# EAGLE board xio5 (EAGLE 9.5.0), part 1 of 3
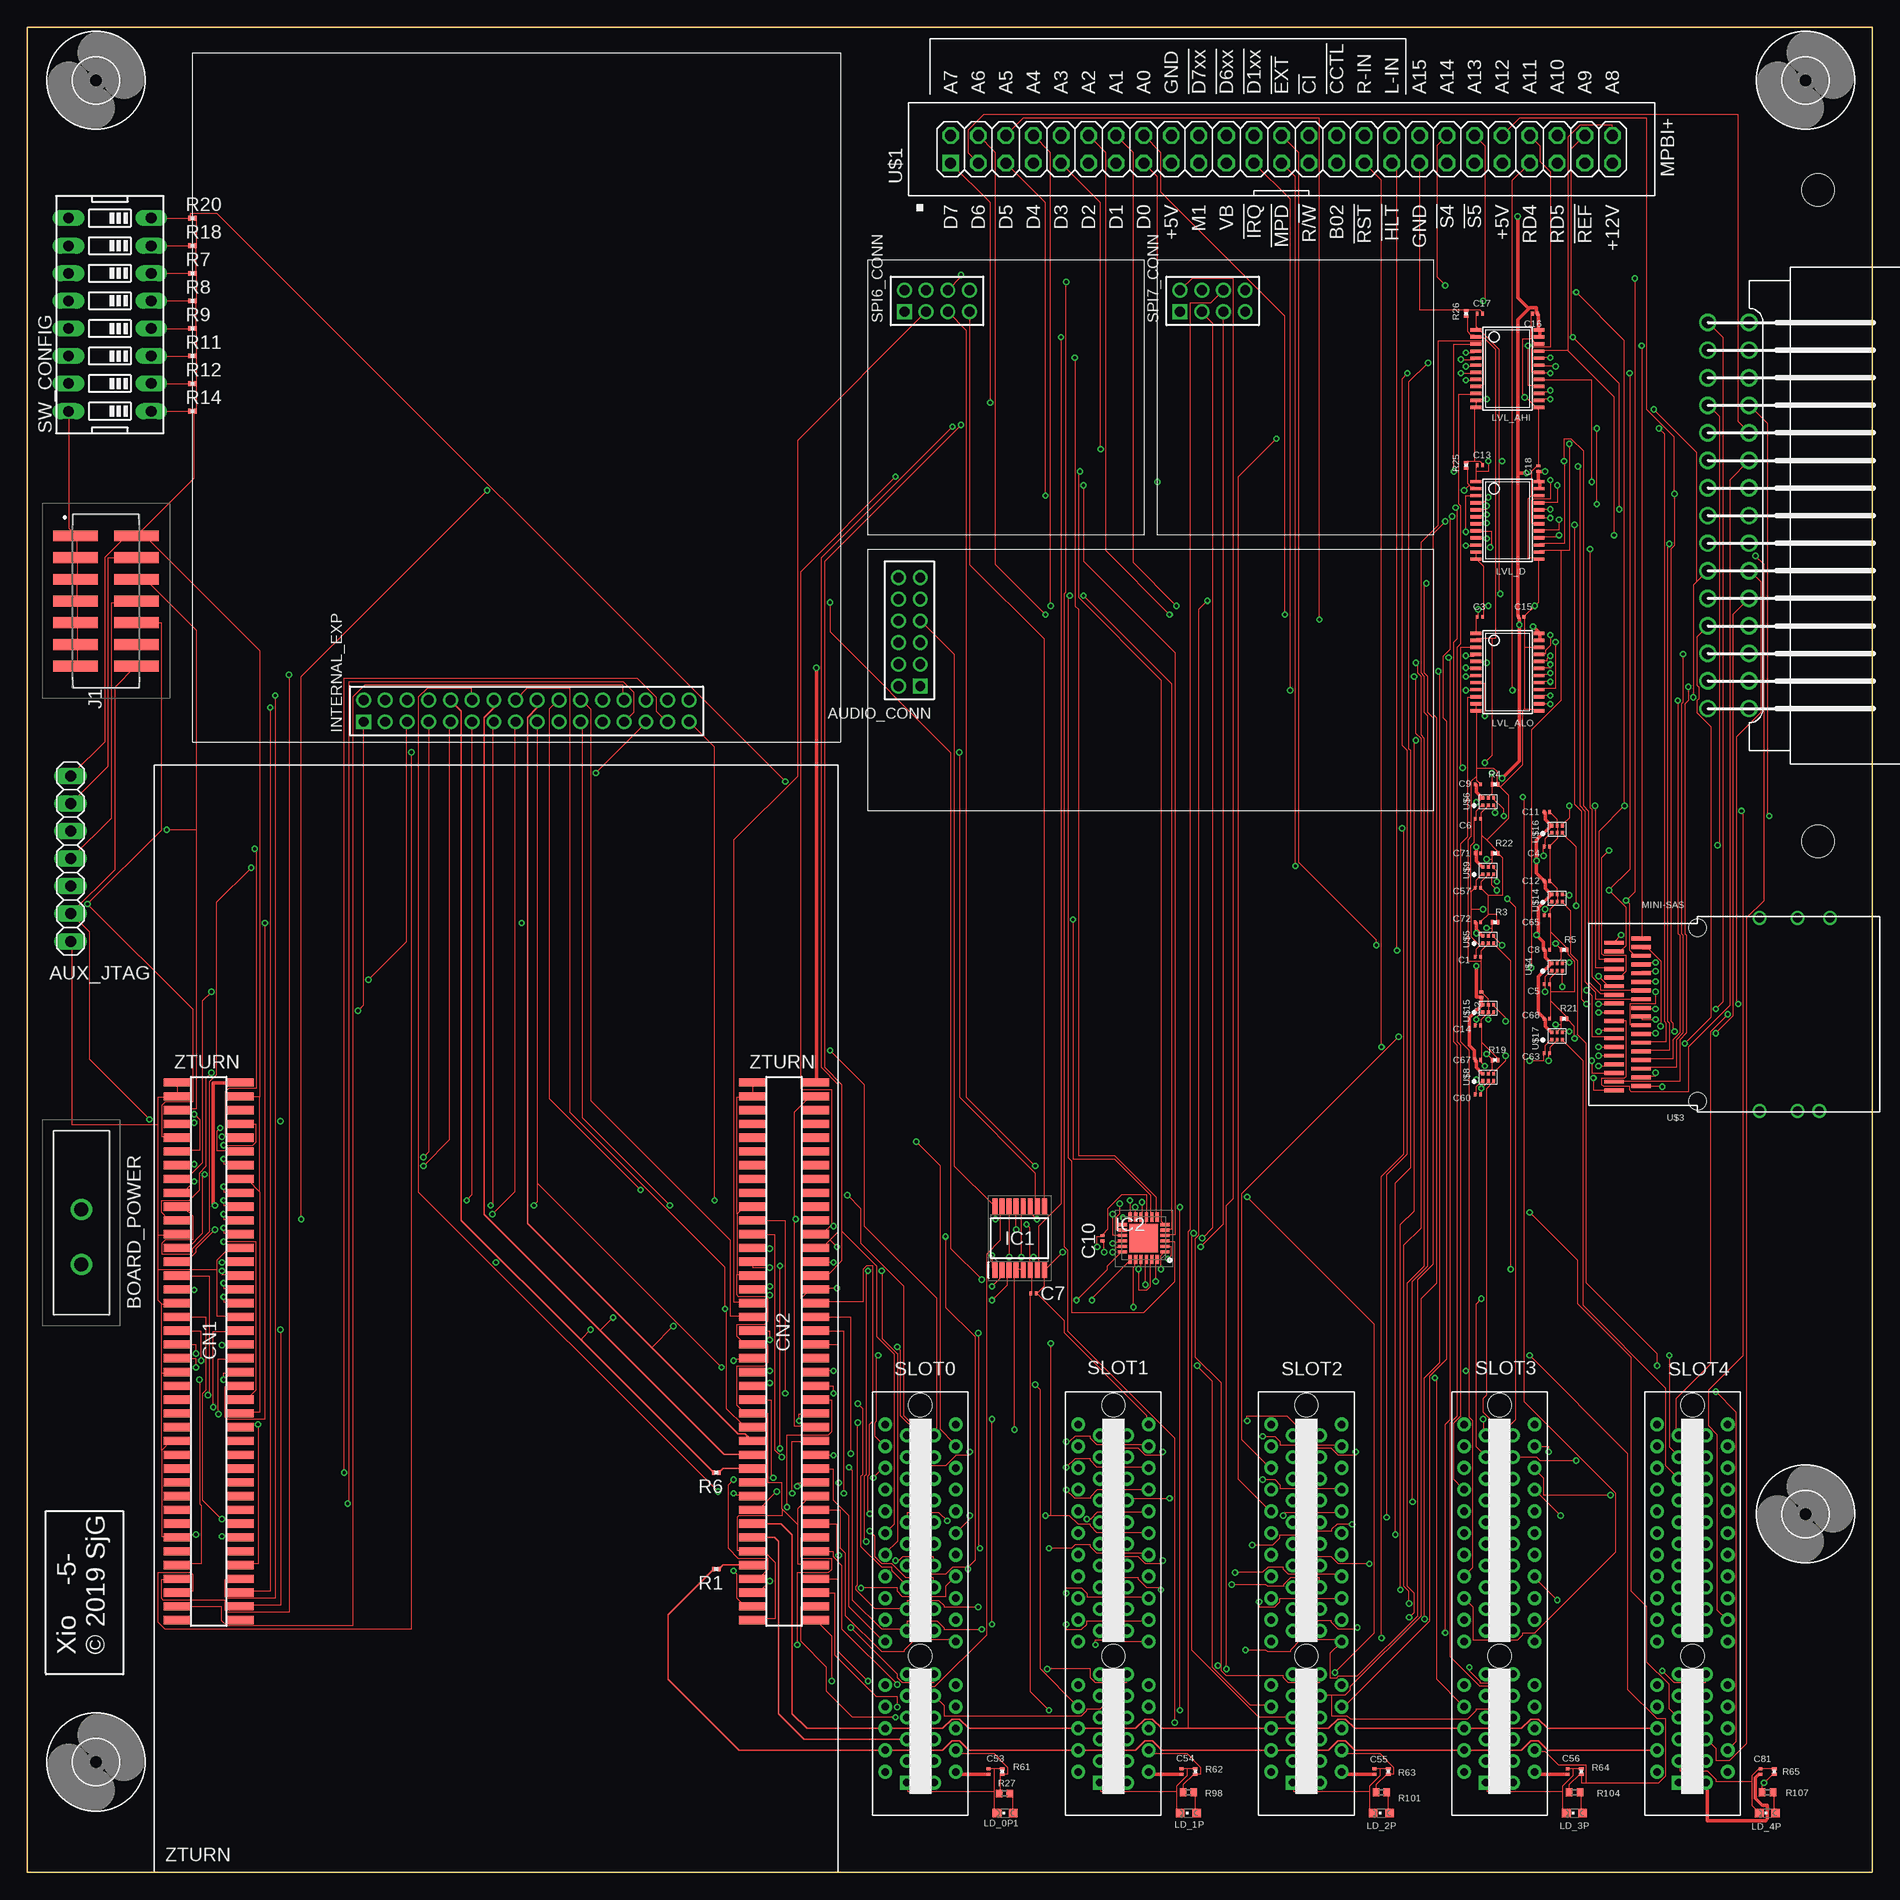
[diagram p13: board, top side]
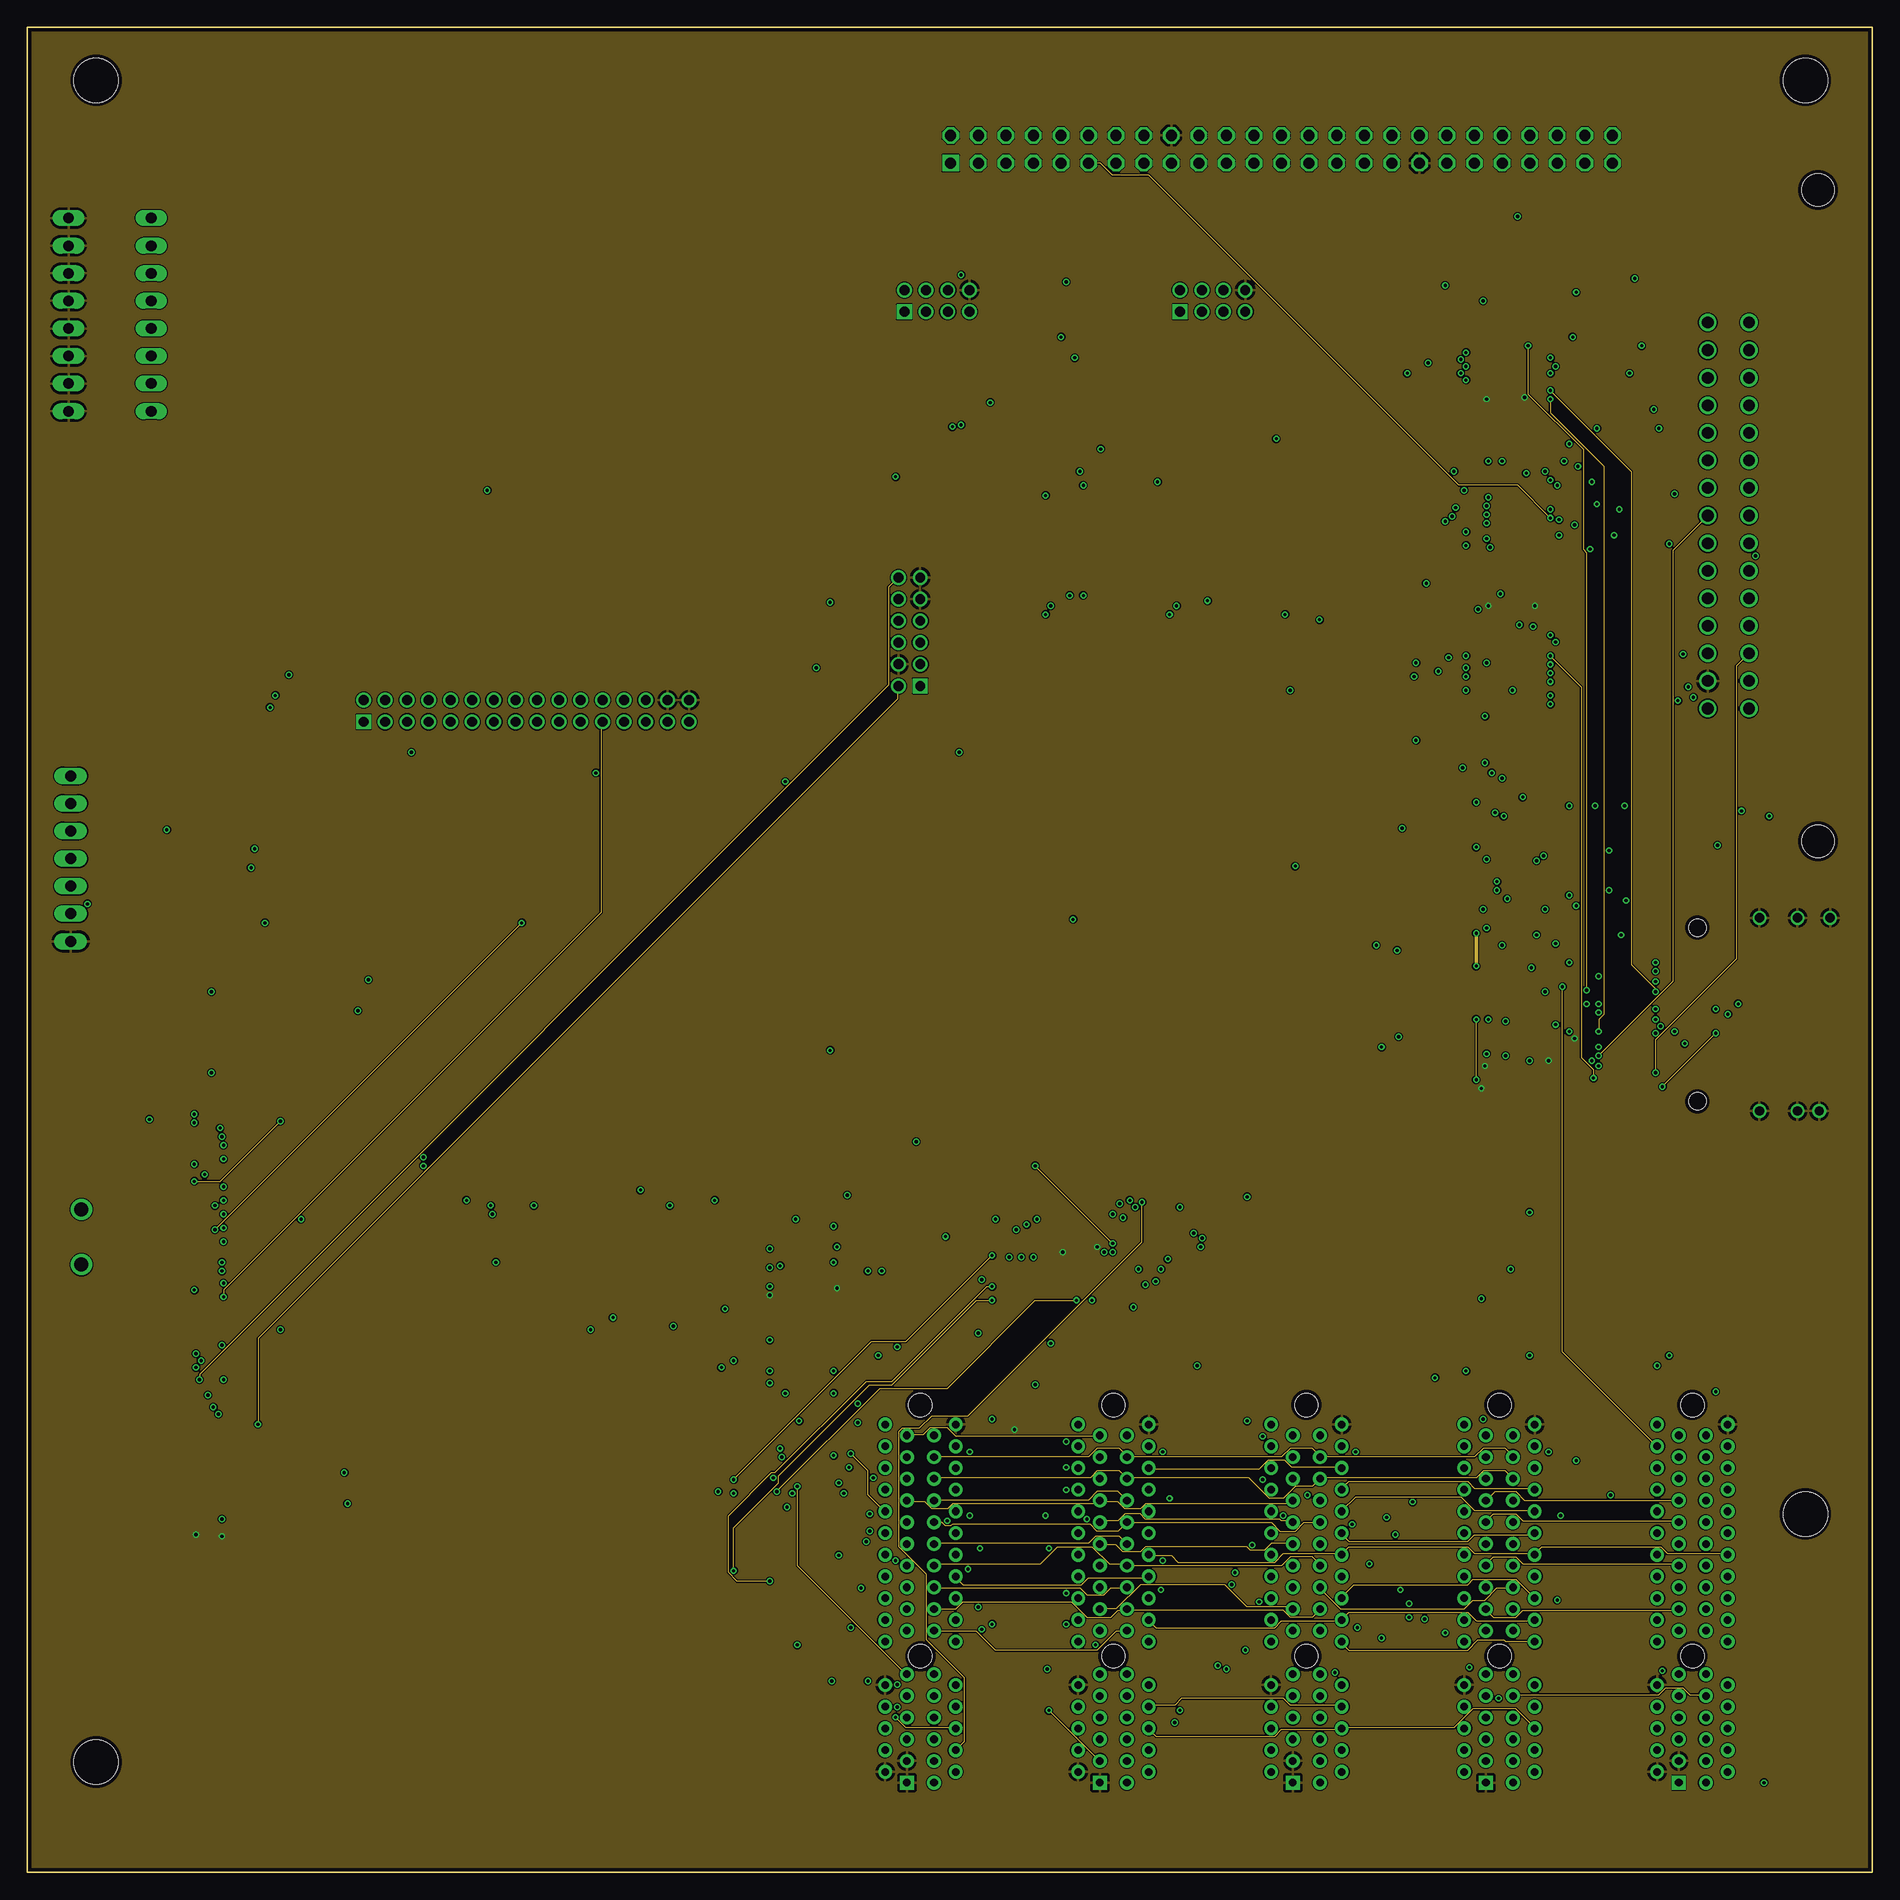
[diagram p14: board, inner layer Route2]
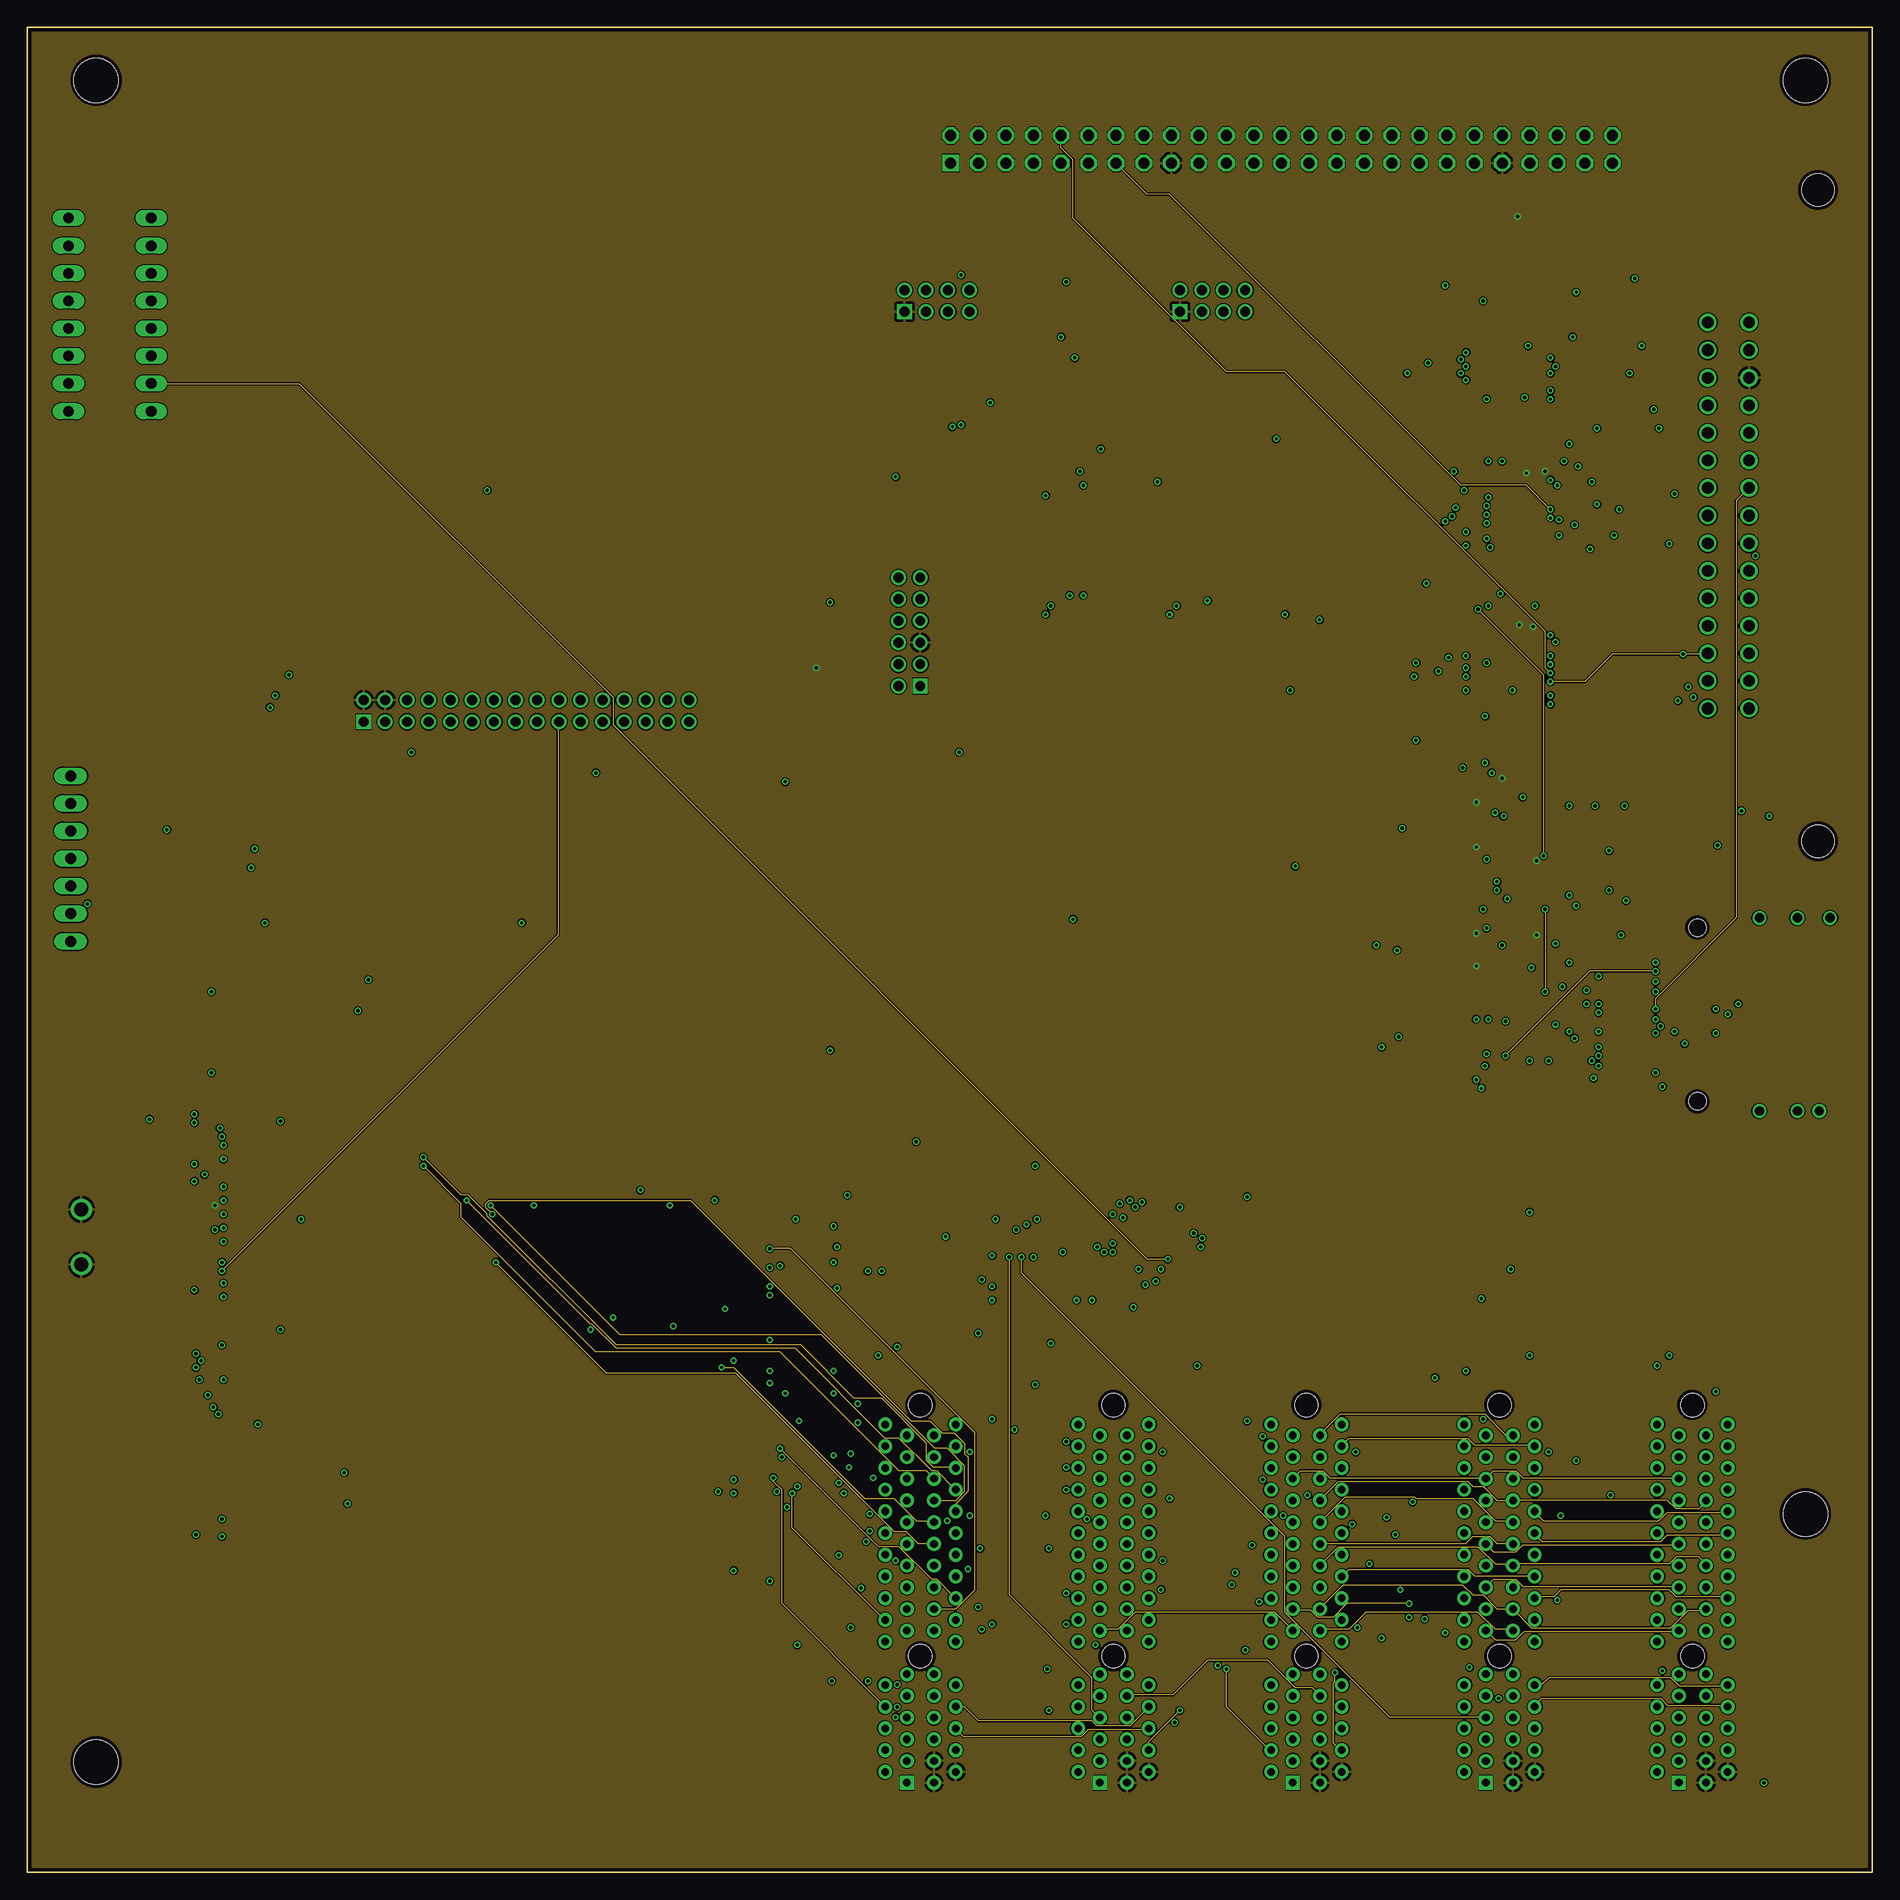
[diagram p15: board, inner layer Route15]
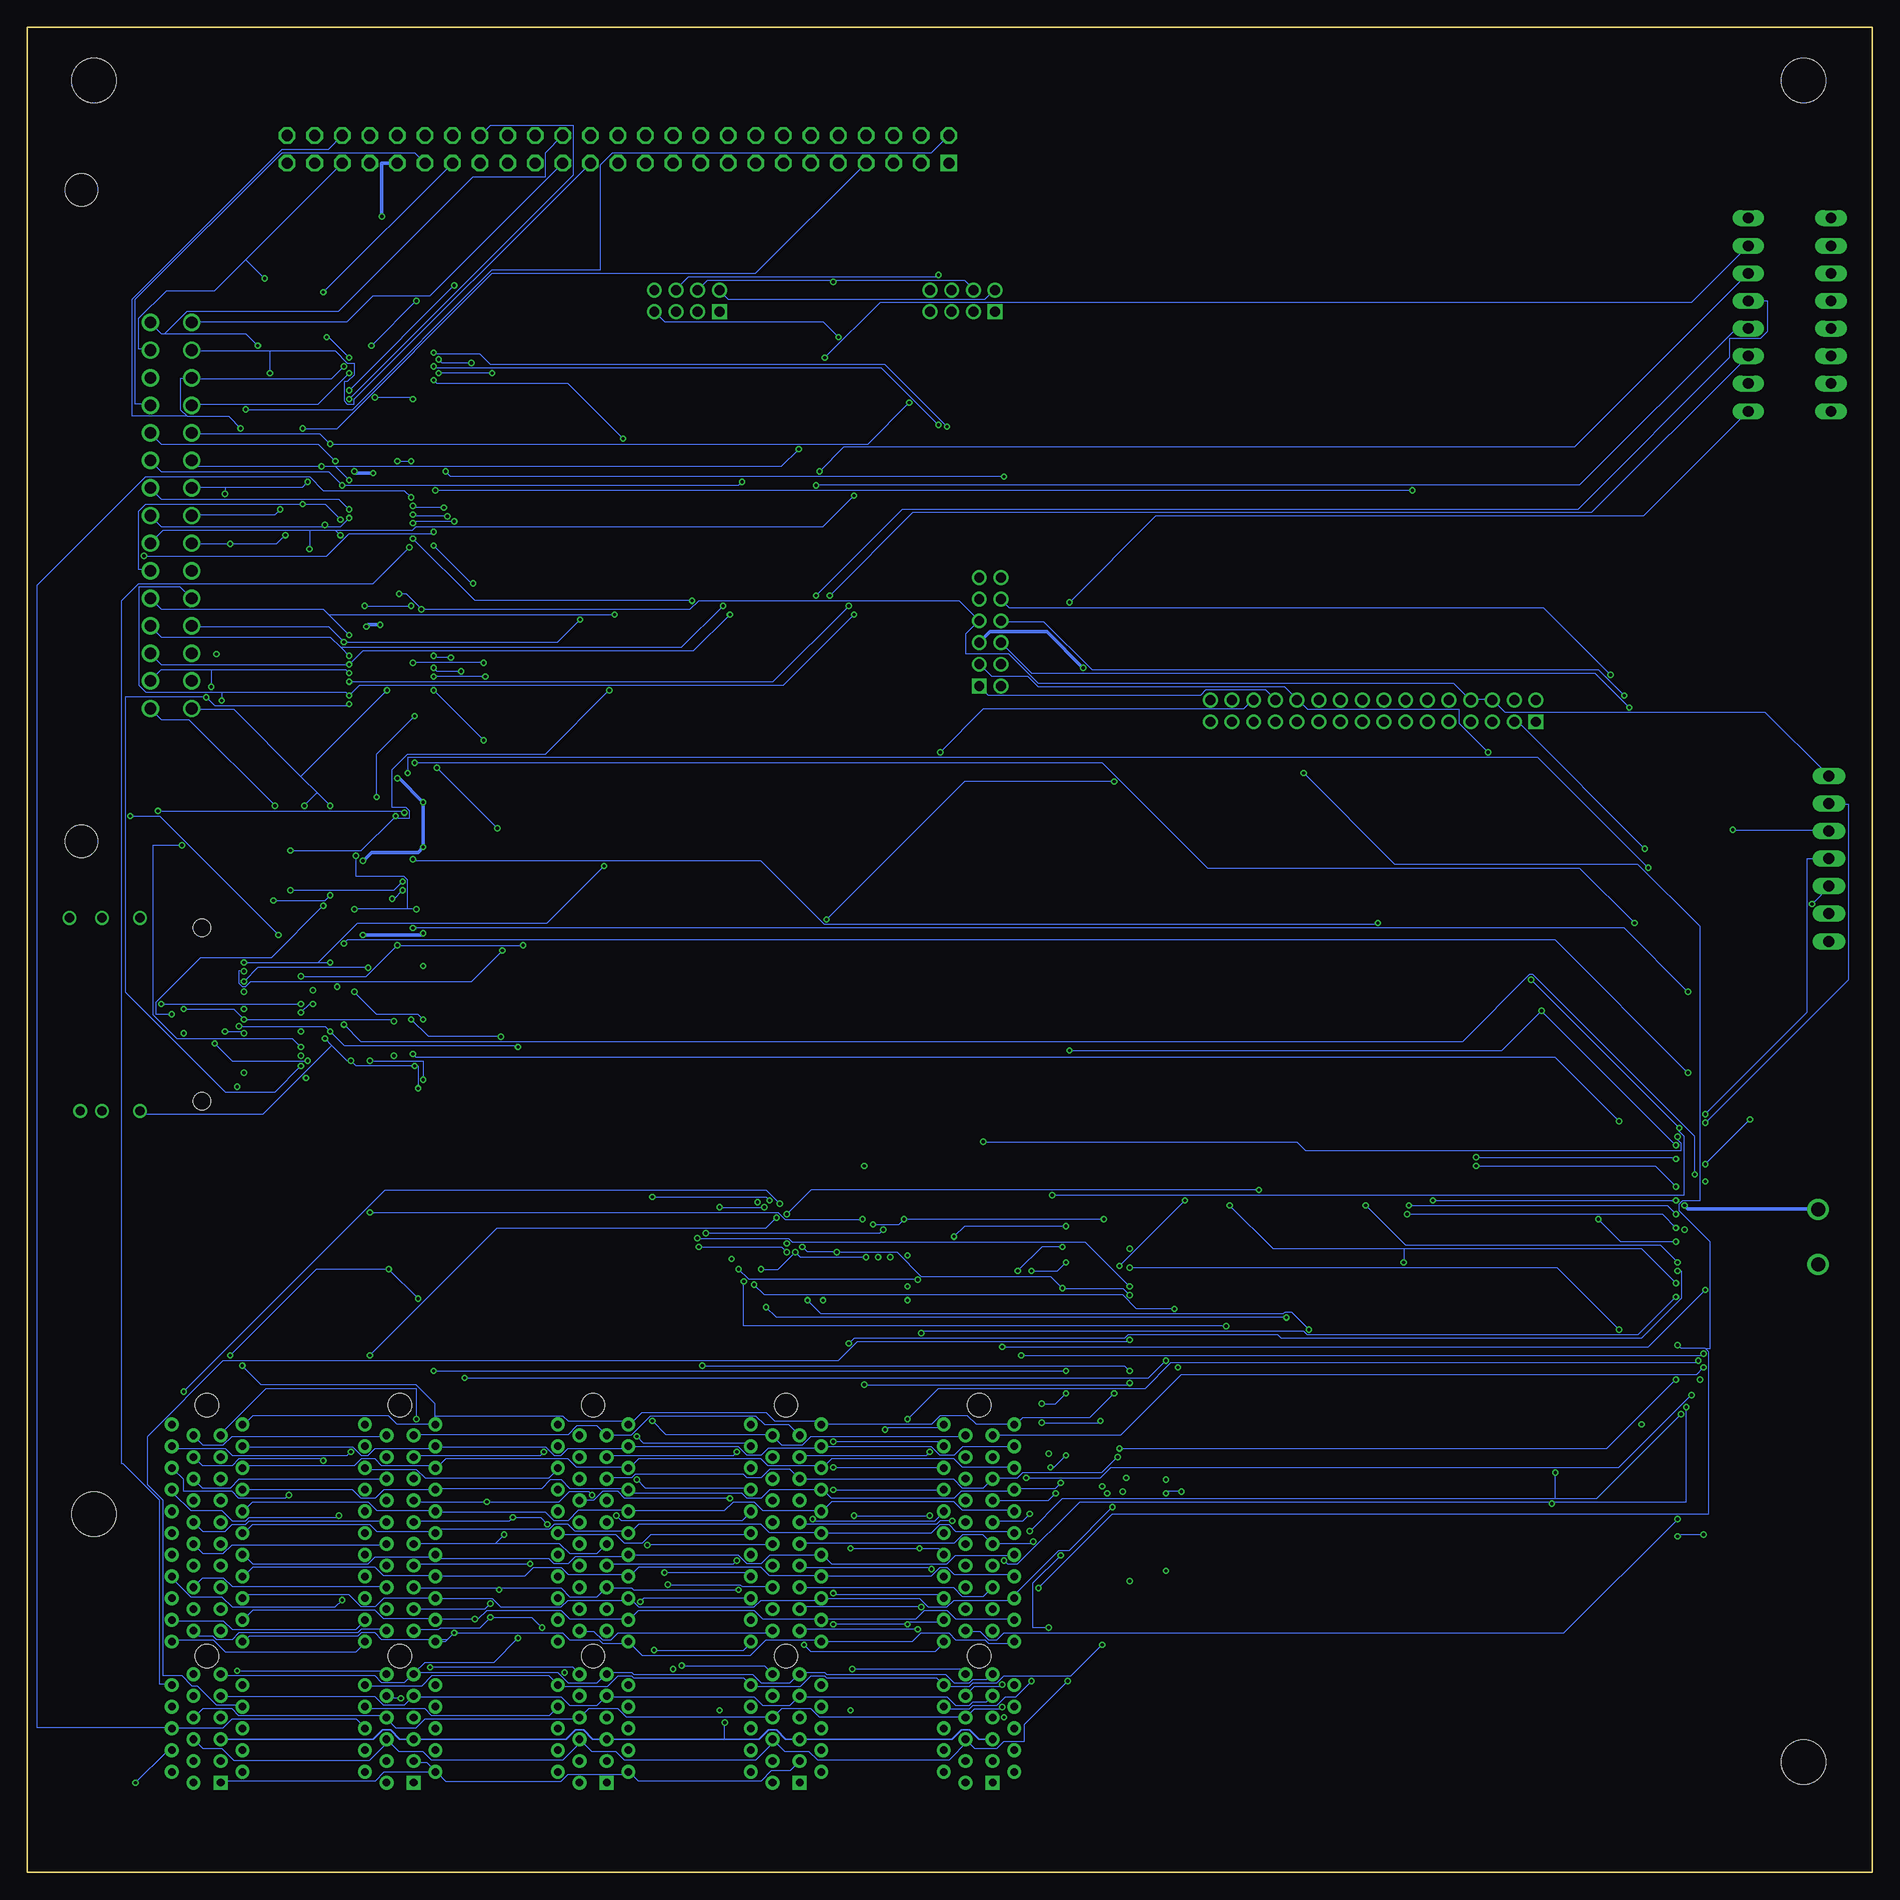
[diagram p16: board, bottom side, seen from below]

Size 170 x 170 mm. Coordinates in mm from the lower left corner, seen from the top.
Outline: 0,170 170,170 170,0 0,0 0,170
Copper layers (1+2*3+14*15+16): Top 0.035mm / dielectric 0.12mm / Route2 0.017mm / dielectric 0.5mm / Route3 0.017mm / dielectric 0.24mm / Route14 0.017mm / dielectric 0.5mm / Route15 0.017mm / dielectric 0.12mm / Bottom 0.035mm
Design rules "seed-6layer-4.4 *": minimum track width 4mil, minimum drill 0.3mm, track to track 4mil, track to pad 4mil, pad to pad 4mil, via to via 4mil, smd to smd 0mil, copper to edge 12mil, drill to drill 12mil, minimum pad ring 6mil, minimum via ring 5.5mil, stop-mask expansion 4mil, vias tented up to drill 25mil, thermal gap 10mil
Net classes: 1 Power: width 0.305 mm, drill 0.203 mm; 2 Slot-power: width 0.508 mm; 3 tx100: width 0.254 mm, clearance 0.457 mm; 4 usb90: width 0.254 mm, clearance 0.178 mm; 5 cclk50: width 0.203 mm; 6 3v3: width 0.254 mm; 7 vccint_aux: width 0.305 mm; 14 qspi: width 0.203 mm
Holes 3 mm at 165,95 165,155

## Footprints (pad centres in the part's own frame; a part is rotated, then mirrored left to right if it is on the bottom)
2X06M = drill 0.914 square: 1 -5,-1 | drill 0.914: 2 -5,1; 3 -3,-1; 4 -3,1; 5 -1,-1; 6 -1,1; 7 1,-1; 8 1,1; 9 3,-1; 10 3,1; 11 5,-1; 12 5,1
1X07 = drill 1.016 long: 1 -7.62,0; 2 -5.08,0; 3 -2.54,0; 4 0,0; 5 2.54,0; 6 5.08,0; 7 7.62,0
1706714 = drill 1.3 pad 1.95: 1 0,0; 2 0,5.08
C0201 = smd 0.25 x 0.35: 1 -0.25,0; 2 0.25,0
A8_CART = drill 1.067: P1 -17.78,6.35; P2 -15.24,6.35; P3 -12.7,6.35; P4 -10.16,6.35; P5 -7.62,6.35; P6 -5.08,6.35; P7 -2.54,6.35; P8 0,6.35; P9 2.54,6.35; P10 5.08,6.35; P11 7.62,6.35; P12 10.16,6.35; P13 12.7,6.35; P14 15.24,6.35; P15 17.78,6.35; PA -17.78,10.16; PB -15.24,10.16; PC -12.7,10.16; PD -10.16,10.16; PE -7.62,10.16; PF -5.08,10.16; PH -2.54,10.16; PJ 0,10.16; PK 2.54,10.16; PL 5.08,10.16; PM 7.62,10.16; PN 10.16,10.16; PP 12.7,10.16; PR 15.24,10.16; PS 17.78,10.16
4,1 = hole 4.1: 0,0
SOP65P640X120-16N = smd 1.475 x 0.45: 1 -2.938,2.275; 2 -2.938,1.625; 3 -2.938,0.975; 4 -2.938,0.325; 5 -2.938,-0.325; 6 -2.938,-0.975; 7 -2.938,-1.625; 8 -2.938,-2.275; 9 2.938,-2.275; 10 2.938,-1.625; 11 2.938,-0.975; 12 2.938,-0.325; 13 2.938,0.325; 14 2.938,0.975; 15 2.938,1.625; 16 2.938,2.275
QFN50P400X400X100-25N = smd 0.85 x 0.3: 1 -1.95,1.25; 2 -1.95,0.75; 3 -1.95,0.25; 4 -1.95,-0.25; 5 -1.95,-0.75; 6 -1.95,-1.25; 13 1.95,-1.25; 14 1.95,-0.75; 15 1.95,-0.25; 16 1.95,0.25; 17 1.95,0.75; 18 1.95,1.25 | smd 0.3 x 0.85: 7 -1.25,-1.95; 8 -0.75,-1.95; 9 -0.25,-1.95; 10 0.25,-1.95; 11 0.75,-1.95; 12 1.25,-1.95; 19 1.25,1.95; 20 0.75,1.95; 21 0.25,1.95; 22 -0.25,1.95; 23 -0.75,1.95; 24 -1.25,1.95 | smd 2.6 x 2.6: 25 0,0
2X16M = drill 0.914 square: 1 -15,-1 | drill 0.914: 2 -15,1; 3 -13,-1; 4 -13,1; 5 -11,-1; 6 -11,1; 7 -9,-1; 8 -9,1; 9 -7,-1; 10 -7,1; 11 -5,-1; 12 -5,1; 13 -3,-1; 14 -3,1; 15 -1,-1; 16 -1,1; 17 1,-1; 18 1,1; 19 3,-1; 20 3,1; 21 5,-1; 22 5,1; 23 7,-1; 24 7,1; 25 9,-1; 26 9,1; 27 11,-1; 28 11,1; 29 13,-1; 30 13,1; 31 15,-1; 32 15,1
98424G5214ALF = smd 1 x 4.1: A1 -6,-2.8; A2 -4,-2.8; A3 -2,-2.8; A4 0,-2.8; A5 2,-2.8; A6 4,-2.8; A7 6,-2.8; B1 -6,2.8; B2 -4,2.8; B3 -2,2.8; B4 0,2.8; B5 2,2.8; B6 4,2.8; B7 6,2.8
CHIPLED_0603 = smd 0.8 x 0.8: A 0,-0.75; C 0,0.75
TSSOP24 = smd 0.305 x 0.991: 1 -3.575,-2.918; 2 -2.925,-2.918; 3 -2.275,-2.918; 4 -1.625,-2.918; 5 -0.975,-2.918; 6 -0.325,-2.918; 7 0.325,-2.918; 8 0.975,-2.918; 9 1.625,-2.918; 10 2.275,-2.918; 11 2.925,-2.918; 12 3.575,-2.918; 13 3.575,2.918; 14 2.925,2.918; 15 2.275,2.918; 16 1.625,2.918; 17 0.975,2.918; 18 0.325,2.918; 19 -0.325,2.918; 20 -0.975,2.918; 21 -1.625,2.918; 22 -2.275,2.918; 23 -2.925,2.918; 24 -3.575,2.918
R0201 = smd 0.28 x 0.43: 1 -0.255,0; 2 0.255,0
R0402 = smd 0.6 x 0.7: 1 -0.5,0; 2 0.5,0
PCI-E_64 = drill 0.7 pad 1.27 square: A1 -12.06,1.5 | drill 0.7 pad 1.27: A2 -11.06,3.5; A3 -10.06,1.5; A4 -9.06,3.5; A5 -8.06,1.5; A6 -7.06,3.5; A7 -6.06,1.5; A8 -5.06,3.5; A9 -4.06,1.5; A10 -3.06,3.5; A11 -2.06,1.5; A12 0.94,3.5; A13 1.94,1.5; A14 2.94,3.5; A15 3.94,1.5; A16 4.94,3.5; A17 5.94,1.5; A18 6.94,3.5; A19 7.94,1.5; A20 8.94,3.5; A21 9.94,1.5; A22 10.94,3.5; A23 11.94,1.5; A24 12.94,3.5; A25 13.94,1.5; A26 14.94,3.5; A27 15.94,1.5; A28 16.94,3.5; A29 17.94,1.5; A30 18.94,3.5; A31 19.94,1.5; A32 20.94,3.5; B1 -12.06,-1; B2 -11.06,-3; B3 -10.06,-1; B4 -9.06,-3; B5 -8.06,-1; B6 -7.06,-3; B7 -6.06,-1; B8 -5.06,-3; B9 -4.06,-1; B10 -3.06,-3; B11 -2.06,-1; B12 0.94,-3; B13 1.94,-1; B14 2.94,-3; B15 3.94,-1; B16 4.94,-3; B17 5.94,-1; B18 6.94,-3; B19 7.94,-1; B20 8.94,-3; B21 9.94,-1; B22 10.94,-3; B23 11.94,-1; B24 12.94,-3; B25 13.94,-1; B26 14.94,-3; B27 15.94,-1; B28 16.94,-3; B29 17.94,-1; B30 18.94,-3; B31 19.94,-1; B32 20.94,-3 | hole 2.15: -0.41,0.25; 22.74,0.25
2X04M = drill 0.914 square: 1 -3,-1 | drill 0.914: 2 -3,1; 3 -1,-1; 4 -1,1; 5 1,-1; 6 1,1; 7 3,-1; 8 3,1
DIPSWITCH-08 = drill 0.97 long: 1 -8.89,-3.81; 2 -6.35,-3.81; 3 -3.81,-3.81; 4 -1.27,-3.81; 5 1.27,-3.81; 6 3.81,-3.81; 7 6.35,-3.81; 8 8.89,-3.81; 9 8.89,3.81; 10 6.35,3.81; 11 3.81,3.81; 12 1.27,3.81; 13 -1.27,3.81; 14 -3.81,3.81; 15 -6.35,3.81; 16 -8.89,3.81
2X25 = drill 1.016 square: 1 -1.27,30.48 | drill 1.016 octagon: 2 1.27,30.48; 3 -1.27,27.94; 4 1.27,27.94; 5 -1.27,25.4; 6 1.27,25.4; 7 -1.27,22.86; 8 1.27,22.86; 9 -1.27,20.32; 10 1.27,20.32; 11 -1.27,17.78; 12 1.27,17.78; 13 -1.27,15.24; 14 1.27,15.24; 15 -1.27,12.7; 16 1.27,12.7; 17 -1.27,10.16; 18 1.27,10.16; 19 -1.27,7.62; 20 1.27,7.62; 21 -1.27,5.08; 22 1.27,5.08; 23 -1.27,2.54; 24 1.27,2.54; 25 -1.27,0; 26 1.27,0; 27 -1.27,-2.54; 28 1.27,-2.54; 29 -1.27,-5.08; 30 1.27,-5.08; 31 -1.27,-7.62; 32 1.27,-7.62; 33 -1.27,-10.16; 34 1.27,-10.16; 35 -1.27,-12.7; 36 1.27,-12.7; 37 -1.27,-15.24; 38 1.27,-15.24; 39 -1.27,-17.78; 40 1.27,-17.78; 41 -1.27,-20.32; 42 1.27,-20.32; 43 -1.27,-22.86; 44 1.27,-22.86; 45 -1.27,-25.4; 46 1.27,-25.4; 47 -1.27,-27.94; 48 1.27,-27.94; 49 -1.27,-30.48; 50 1.27,-30.48
MINI-SAS = smd 0.35 x 1.8: PA1 -6.2,8.78; PA2 -5.4,8.78; PA3 -4.6,8.78; PA4 -3.8,8.78; PA5 -3,8.78; PA6 -2.2,8.78; PA7 -1.4,8.78; PA8 -0.6,8.78; PA9 0.2,8.78; PA10 1,8.78; PA11 1.8,8.78; PA12 2.6,8.78; PA13 3.4,8.78; PA14 4.2,8.78; PA15 5,8.78; PA16 5.8,8.78; PA17 6.6,8.78; PA18 7.4,8.78; PB1 -6.6,11.29; PB2 -5.8,11.29; PB3 -5,11.29; PB4 -4.2,11.29; PB5 -3.4,11.29; PB6 -2.6,11.29; PB7 -1.8,11.29; PB8 -1,11.29; PB9 -0.2,11.29; PB10 0.6,11.29; PB11 1.4,11.29; PB12 2.2,11.29; PB13 3,11.29; PB14 3.8,11.29; PB15 4.6,11.29; PB16 5.4,11.29; PB17 6.2,11.29; PB18 7,11.29 | drill 0.85: SHIELD1 -8.5,-2.12; SHIELD2 -8.5,-5.62; SHIELD3 -8.5,-7.62; SHIELD4 9.3,-2.12; SHIELD5 9.3,-5.62; SHIELD6 9.3,-8.62 | hole 1.6: -7.6,3.6; 8.4,3.6
SOT886 = smd 0.325 x 0.27: 1 -0.338,0.5; 2 -0.338,0; 3 -0.338,-0.5; 4 0.338,-0.5; 5 0.338,0; 6 0.338,0.5
ZTURN = smd 2.4 x 0.76: CN1_1 -24.05,24.765; CN1_2 -29.95,24.765; CN1_3 -24.05,23.495; CN1_4 -29.95,23.495; CN1_5 -24.05,22.225; CN1_6 -29.95,22.225; CN1_7 -24.05,20.955; CN1_8 -29.95,20.955; CN1_9 -24.05,19.685; CN1_10 -29.95,19.685; CN1_11 -24.05,18.415; CN1_12 -29.95,18.415; CN1_13 -24.05,17.145; CN1_14 -29.95,17.145; CN1_15 -24.05,15.875; CN1_16 -29.95,15.875; CN1_17 -24.05,14.605; CN1_18 -29.95,14.605; CN1_19 -24.05,13.335; CN1_20 -29.95,13.335; CN1_21 -24.05,12.065; CN1_22 -29.95,12.065; CN1_23 -24.05,10.795; CN1_24 -29.95,10.795; CN1_25 -24.05,9.525; CN1_26 -29.95,9.525; CN1_27 -24.05,8.255; CN1_28 -29.95,8.255; CN1_29 -24.05,6.985; CN1_30 -29.95,6.985; CN1_31 -24.05,5.715; CN1_32 -29.95,5.715; CN1_33 -24.05,4.445; CN1_34 -29.95,4.445; CN1_35 -24.05,3.175; CN1_36 -29.95,3.175; CN1_37 -24.05,1.905; CN1_38 -29.95,1.905; CN1_39 -24.05,0.635; CN1_40 -29.95,0.635; CN1_41 -24.05,-0.635; CN1_42 -29.95,-0.635; CN1_43 -24.05,-1.905; CN1_44 -29.95,-1.905; CN1_45 -24.05,-3.175; CN1_46 -29.95,-3.175; CN1_47 -24.05,-4.445; CN1_48 -29.95,-4.445; CN1_49 -24.05,-5.715; CN1_50 -29.95,-5.715; CN1_51 -24.05,-6.985; CN1_52 -29.95,-6.985; CN1_53 -24.05,-8.255; CN1_54 -29.95,-8.255; CN1_55 -24.05,-9.525; CN1_56 -29.95,-9.525; CN1_57 -24.05,-10.795; CN1_58 -29.95,-10.795; CN1_59 -24.05,-12.065; CN1_60 -29.95,-12.065; CN1_61 -24.05,-13.335; CN1_62 -29.95,-13.335; CN1_63 -24.05,-14.605; CN1_64 -29.95,-14.605; CN1_65 -24.05,-15.875; CN1_66 -29.95,-15.875; CN1_67 -24.05,-17.145; CN1_68 -29.95,-17.145; CN1_69 -24.05,-18.415; CN1_70 -29.95,-18.415; CN1_71 -24.05,-19.685; CN1_72 -29.95,-19.685; CN1_73 -24.05,-20.955; CN1_74 -29.95,-20.955; CN1_75 -24.05,-22.225; CN1_76 -29.95,-22.225; CN1_77 -24.05,-23.495; CN1_78 -29.95,-23.495; CN1_79 -24.05,-24.765; CN1_80 -29.95,-24.765; CN2_1 28.95,24.765; CN2_2 23.05,24.765; CN2_3 28.95,23.495; CN2_4 23.05,23.495; CN2_5 28.95,22.225; CN2_6 23.05,22.225; CN2_7 28.95,20.955; CN2_8 23.05,20.955; CN2_9 28.95,19.685; CN2_10 23.05,19.685; CN2_11 28.95,18.415; CN2_12 23.05,18.415; CN2_13 28.95,17.145; CN2_14 23.05,17.145; CN2_15 28.95,15.875; CN2_16 23.05,15.875; CN2_17 28.95,14.605; CN2_18 23.05,14.605; CN2_19 28.95,13.335; CN2_20 23.05,13.335; CN2_21 28.95,12.065; CN2_22 23.05,12.065; CN2_23 28.95,10.795; CN2_24 23.05,10.795; CN2_25 28.95,9.525; CN2_26 23.05,9.525; CN2_27 28.95,8.255; CN2_28 23.05,8.255; CN2_29 28.95,6.985; CN2_30 23.05,6.985; CN2_31 28.95,5.715; CN2_32 23.05,5.715; CN2_33 28.95,4.445; CN2_34 23.05,4.445; CN2_35 28.95,3.175; CN2_36 23.05,3.175; CN2_37 28.95,1.905; CN2_38 23.05,1.905; CN2_39 28.95,0.635; CN2_40 23.05,0.635; CN2_41 28.95,-0.635; CN2_42 23.05,-0.635; CN2_43 28.95,-1.905; CN2_44 23.05,-1.905; CN2_45 28.95,-3.175; CN2_46 23.05,-3.175; CN2_47 28.95,-4.445; CN2_48 23.05,-4.445; CN2_49 28.95,-5.715; CN2_50 23.05,-5.715; CN2_51 28.95,-6.985; CN2_52 23.05,-6.985; CN2_53 28.95,-8.255; CN2_54 23.05,-8.255; CN2_55 28.95,-9.525; CN2_56 23.05,-9.525; CN2_57 28.95,-10.795; CN2_58 23.05,-10.795; CN2_59 28.95,-12.065; CN2_60 23.05,-12.065; CN2_61 28.95,-13.335; CN2_62 23.05,-13.335; CN2_63 28.95,-14.605; CN2_64 23.05,-14.605; CN2_65 28.95,-15.875; CN2_66 23.05,-15.875; CN2_67 28.95,-17.145; CN2_68 23.05,-17.145; CN2_69 28.95,-18.415; CN2_70 23.05,-18.415; CN2_71 28.95,-19.685; CN2_72 23.05,-19.685; CN2_73 28.95,-20.955; CN2_74 23.05,-20.955; CN2_75 28.95,-22.225; CN2_76 23.05,-22.225; CN2_77 28.95,-23.495; CN2_78 23.05,-23.495; CN2_79 28.95,-24.765; CN2_80 23.05,-24.765

## Placement (x,y rotation side)
AUDIO_CONN  [2X06M]  81.28,114.3 90 top
AUX_JTAG  [1X07]  4,93.4 270 top
BOARD_POWER  1706714  [1706714]  5,56 0 top
C1  0.1uF  [C0201]  133.65,84.36 0 top
C2  0.1uF  [C0201]  133.97,80.87 90 top
C3  0.1uF  [C0201]  133.84,115.67 0 top
C4  0.1uF  [C0201]  140,94.52 0 top
C5  0.1uF  [C0201]  140,81.82 0 top
C6  0.1uF  [C0201]  133.65,97.06 0 top
C7  0.1uF  [C0201]  92.71,53.34 0 top
C8  0.1uF  [C0201]  140,85 0 top
C9  0.1uF  [C0201]  133.65,100.23 0 top
C10  0.1uF  [C0201]  99.06,58.42 90 top
C11  0.1uF  [C0201]  140,97.69 0 top
C12  0.1uF  [C0201]  140,91.34 0 top
C13  0.1uF  [C0201]  133.84,129.64 0 top
C14  0.1uF  [C0201]  133.65,78.01 0 top
C15  0.1uF  [C0201]  137.65,115.67 0 top
C16  0.1uF  [C0201]  138.92,143.61 180 top
C17  0.1uF  [C0201]  133.84,143.61 0 top
C18  0.1uF  [C0201]  139.24,129.32 90 top
C53  0.1uF  [C0201]  88.58,9.29 90 top
C54  0.1uF  [C0201]  106.36,9.29 90 top
C55  0.1uF  [C0201]  124.14,9.29 90 top
C56  0.1uF  [C0201]  141.91,9.29 90 top
C57  0.1uF  [C0201]  133.65,90.71 0 top
C60  0.1uF  [C0201]  133.65,71.66 0 top
C63  0.1uF  [C0201]  140,75.47 0 top
C65  0.1uF  [C0201]  140,88.17 0 top
C67  0.1uF  [C0201]  133.65,74.83 0 top
C68  0.1uF  [C0201]  140,78.64 0 top
C71  0.1uF  [C0201]  133.65,93.89 0 top
C72  0.1uF  [C0201]  133.65,87.53 0 top
C81  0.1uF  [C0201]  159.69,9.29 90 top
CARTRIDGE  5650118-1  [A8_CART]  165,125 90 top
H3  MOUNT-HOLE4.1  [4,1]  6.35,10.16 0 top
H6  MOUNT-HOLE4.1  [4,1]  6.35,165.1 0 top
H7  MOUNT-HOLE4.1  [4,1]  163.83,165.1 0 top
H8  MOUNT-HOLE4.1  [4,1]  163.83,33.02 0 top
IC1  SN74LVC138APWR  [SOP65P640X120-16N]  91.44,58.42 90 top
IC2  XRA1405IL24-F  [QFN50P400X400X100-25N]  102.87,58.42 180 top
INTERNAL_EXP  [2X16M]  46,107 0 top
J1  98424-G52-14ALF  [98424G5214ALF]  7.27,117.13 270 top
LD_0P1  SML-D12D1WT86  [CHIPLED_0603]  90.1,5.47 90 top
LD_1P  SML-D12D1WT86  [CHIPLED_0603]  106.99,5.47 90 top
LD_2P  SML-D12D1WT86  [CHIPLED_0603]  124.77,5.47 90 top
LD_3P  SML-D12D1WT86  [CHIPLED_0603]  142.55,5.47 90 top
LD_4P  SML-D12D1WT86  [CHIPLED_0603]  160.33,5.47 90 top
LVL_AHI  SN74LVC8T245  [TSSOP24]  136.38,138.53 270 top
LVL_ALO  SN74LVC8T245  [TSSOP24]  136.38,110.59 270 top
LVL_D  SN74LVC8T245  [TSSOP24]  136.38,124.56 270 top
R1  22R  [R0201]  63.5,27.94 180 top
R3  10K  [R0201]  135.24,87.53 0 top
R4  10K  [R0201]  135.24,100.23 0 top
R5  10K  [R0201]  141.59,85 0 top
R6  22R  [R0201]  63.5,36.83 180 top
R7  10K  [R0201]  15.24,147.32 0 top
R8  10K  [R0201]  15.24,144.78 0 top
R9  10K  [R0201]  15.24,142.24 0 top
R11  10K  [R0201]  15.24,139.7 0 top
R12  10K  [R0201]  15.24,137.16 0 top
R14  10K  [R0201]  15.24,134.62 0 top
R18  10K  [R0201]  15.24,149.86 0 top
R19  10K  [R0201]  135.24,74.83 0 top
R20  10K  [R0201]  15.24,152.4 0 top
R21  10K  [R0201]  141.59,78.64 0 top
R22  10K  [R0201]  135.24,93.89 0 top
R25  10K  [R0201]  132.57,129.64 90 top
R26  10K  [R0201]  132.57,143.61 90 top
R27  59R  [R0402]  90.05,7.28 0 top
R61  10K  [R0201]  89.84,9.29 270 top
R62  10K  [R0201]  107.62,9.29 270 top
R63  10K  [R0201]  125.41,9.29 270 top
R64  10K  [R0201]  143.19,9.29 270 top
R65  10K  [R0201]  160.97,9.29 270 top
R98  59R  [R0402]  106.99,7.38 0 top
R101  59R  [R0402]  124.77,7.38 0 top
R104  59R  [R0402]  142.55,7.38 0 top
R107  59R  [R0402]  160.33,7.38 0 top
SLOT0  PCIE_64  [PCI-E_64]  82.55,20.32 90 top
SLOT1  PCIE_64  [PCI-E_64]  100.33,20.32 90 top
SLOT2  PCIE_64  [PCI-E_64]  118.11,20.32 90 top
SLOT3  PCIE_64  [PCI-E_64]  135.89,20.32 90 top
SLOT4  PCIE_64  [PCI-E_64]  153.67,20.32 90 top
SPI6_CONN  [2X04M]  83.82,144.78 0 top
SPI7_CONN  [2X04M]  109.22,144.78 0 top
SW_CONFIG  [DIPSWITCH-08]  7.62,143.51 90 top
U$1  MPBI+  [2X25]  115.57,158.75 90 top
U$3  MINI-SAS  [MINI-SAS]  157.48,78.64 90 top
U$4  74LVC1T45GWSOT866  [SOT886]  140.96,83.41 90 top
U$5  74LVC1T45GWSOT866  [SOT886]  134.6,85.95 90 top
U$6  74LVC1T45GWSOT866  [SOT886]  134.6,98.65 90 top
U$8  74LVC1T45GWSOT866  [SOT886]  134.6,73.25 90 top
U$9  74LVC1T45GWSOT866  [SOT886]  134.6,92.3 90 top
U$14  74LVC1T45GWSOT866  [SOT886]  140.96,89.76 90 top
U$15  74LVC1T45GWSOT866  [SOT886]  134.6,79.6 90 top
U$16  74LVC1T45GWSOT866  [SOT886]  140.96,96.11 90 top
U$17  74LVC1T45GWSOT866  [SOT886]  140.96,77.06 90 top
ZTURN  ZTURN  [ZTURN]  43.73,48 0 top

## Tracks (layer width: path | path; a pad name or v marks a point on that pad's centre or on a via)
!AVALID!
  Bottom 0.102: SLOT0.A9 81.12,16.19 81.6,15.72 82.87,15.72 83.19,15.4 84.45,15.4 85.25,16.19 98.74,16.19 SLOT1.A9 98.9,16.19 99.69,15.4 102.23,15.4 103.03,16.19 116.52,16.19 SLOT2.A9 116.68,16.19 117.47,15.4 120.02,15.4 120.81,16.19 134.3,16.19 SLOT3.A9 134.46,16.19 135.25,15.4 137.16,15.4 137.95,16.19 152.08,16.19 SLOT4.A9
!HDMI_INT!  (via drill 0.3)
  Top 0.102: v23.34,50.01 23.34,24.61 19.68,24.61 ZTURN.CN1_77 | v68.42,55.72 66.83,55.72 66.83,56.2 ZTURN.CN2_28
  Bottom 0.102: v23.34,50.01 29.05,55.72 v68.42,55.72
!HI_CCTL!  (via drill 0.3)
  Top 0.102: v148.75,140.65 148.75,86.04 U$3.PA18
  Bottom 0.102: v148.75,140.65 149.86,141.76 157.32,141.76 | 157.32,141.76 157.64,141.76 158.59,142.72 CARTRIDGE.P15 | U$1.30 122.24,158.43 122.24,156.21 128.91,156.21 141.29,143.83 155.26,143.83 157.32,141.76
!HI_EXTSEL!  (via drill 0.3)
  Top 0.102: v135.89,85.41 135.1,86.2 U$5.4 | v144.78,82.55 145.57,81.76 146.05,81.76 U$3.PB13 | U$1.26 117.16,158.43 117.16,93.03 124.3,85.88 v124.3,85.41
  Bottom 0.102: v144.78,82.55 138.75,82.55 v135.89,85.41 v124.3,85.41
!HI_HALT!  (via drill 0.3)
  Top 0.102: v136.21,75.25 136.21,74.77 135.1,73.66 U$8.4 | v150.02,83.03 148.75,83.03 148.75,82.87 U$3.PA14 | U$1.33 126.21,157 v126.21,84.93
  Route15 0.102: v136.21,75.25 143.99,83.03 v150.02,83.03
  Bottom 0.102: v126.21,84.93 129.06,82.07 149.38,82.07 149.86,81.6 150.18,81.6 150.5,81.92 150.5,83.03 v150.02,83.03
!HI_IRQ!  (via drill 0.3)
  Top 0.102: v136.05,97.31 136.05,97.95 135.1,98.9 U$6.4 | v145.73,94.14 145.1,93.5 145.1,84.61 145.26,84.45 147.32,84.45 147.32,83.03 146.84,82.55 146.21,82.55 U$3.PB14 | U$1.23 116.36,154.15 v116.36,108.9
  Bottom 0.102: 136.21,97.16 139.22,94.14 v145.73,94.14 | v116.36,108.9 122.24,103.03 134.94,103.03 136.37,101.6 136.37,98.11 135.1,98.11 134.78,97.79 134.78,97.16 136.21,97.16 | 136.21,97.16 v136.05,97.31
!HI_MPD!  (via drill 0.3)
  Top 0.102: v142.08,83.82 141.45,83.82 U$4.4 | v150.02,83.82 148.75,83.82 148.75,83.66 U$3.PA15 | U$1.25 116.84,156.21 v116.84,92.71
  Bottom 0.102: v150.02,83.82 143.19,83.82 | 143.19,83.82 v142.08,83.82 | v116.84,92.71 122.08,87.47 139.54,87.47 143.19,83.82
!HI_RST!  (via drill 0.3)
  Top 0.102: v142.08,77.47 141.45,77.47 U$17.4 | v150.5,77.95 150.5,83.98 149.38,85.09 148.75,85.09 U$3.PA17 | U$1.31 124.78,155.89 v124.78,76.04
  Bottom 0.102: v150.5,77.95 142.56,77.95 v142.08,77.47 140.81,76.2 124.94,76.2 v124.78,76.04
!HI_S4!  (via drill 0.3)
  Top 0.102: U$3.PB16 146.05,84.14 144.78,84.14 144.78,95.89 v147.16,98.27 147.16,141.13 v142.72,145.57
  Bottom 0.102: v147.16,98.27 155.1,106.2 157.64,106.2 158.59,107.16 CARTRIDGE.P1 | v142.72,145.57 U$1.37
!HI_S5!  (via drill 0.3)
  Top 0.102: v146.84,86.36 146.21,85.72 U$3.PB18 | v160.5,97.31 160.34,97.47 160.34,133.51 158.75,135.1 CARTRIDGE.P12
  Bottom 0.102: v146.84,86.36 157.8,97.31 v160.5,97.31 | U$1.39 134.3,158.43 146.53,158.43 160.02,144.94 160.02,135.25 158.75,135.25 CARTRIDGE.P12
!LO_EXTSEL!  (via drill 0.3)
  Top 0.102: v15.4,53.66 13.81,53.66 ZTURN.CN1_32 | v80.17,48.42 80.49,48.1 80.49,42.07 81.92,40.64 81.92,39.21 81.6,38.89 | 81.6,38.89 81.12,38.42 SLOT0.A29 | v104.62,38.73 104.62,38.42 103.03,38.42 102.39,39.05 100.97,39.05 100.49,38.58 100.49,38.42 98.9,38.42 SLOT1.A29 | v136.68,55.56 136.68,83.98 135.1,85.57 U$5.3 | v133.99,52.86 133.51,52.39 133.51,39.21 134.3,38.42 SLOT3.A29 | v151.29,47.62 151.29,39.21 152.08,38.42 SLOT4.A29 | v122.4,38.73 122.4,38.42 120.81,38.42 120.17,39.05 118.75,39.05 118.27,38.58 118.27,38.42 116.68,38.42 SLOT2.A29 | 81.6,38.89 83.03,37.47 84.61,37.47 85.57,38.42 86.84,38.42 v86.84,38.73
  Bottom 0.102: v15.4,53.66 20.64,48.42 v80.17,48.42 | v104.62,38.73 104.93,38.42 116.52,38.42 SLOT2.A29 | v133.99,52.86 v136.68,55.56 143.35,55.56 v151.29,47.62 | v122.4,38.73 122.71,38.42 134.3,38.42 SLOT3.A29 | v86.84,38.73 87.15,38.42 98.74,38.42 SLOT1.A29
!LO_HALT!  (via drill 0.3)
  Top 0.102: v17.94,32.54 16.19,34.29 16.19,44.13 16.51,44.45 16.51,51.12 13.81,51.12 ZTURN.CN1_36 | U$8.3 135.1,72.87 134.46,72.23 134.46,43.97 134.14,43.66 134.14,42.39 135.73,40.8 135.73,23.5 136.84,22.38 SLOT3.B13
  Route2 0.102: SLOT0.B13 83.66,22.23 87.47,22.23 89.22,20.48 98.58,20.48 100.33,22.23 101.28,22.23 SLOT1.B13
  Route15 0.102: SLOT2.B13 119.22,22.38 121.76,22.38 123.35,23.97 133.67,23.97 135.25,22.38 136.84,22.38 SLOT3.B13
  Bottom 0.102: v17.94,32.54 28.42,22.07 80.01,22.07 80.64,21.43 81.44,21.43 82.23,22.23 83.5,22.23 SLOT0.B13 | SLOT1.B13 101.44,22.23 101.6,22.07 115.57,22.07 116.2,21.43 117,21.43 117.79,22.23 119.06,22.23 SLOT2.B13 | SLOT4.B13 154.62,22.23 154.15,21.75 152.88,21.75 152.56,21.43 151.13,21.43 150.5,22.07 139.54,22.07 139.22,22.38 137,22.38 SLOT3.B13
!LO_IRQ!  (via drill 0.3)
  Top 0.102: v135.25,97.63 135.25,98.11 135.1,98.27 U$6.3 | v157.96,97.79 158.12,97.63 158.12,47.62 154.94,44.45 154.94,41.12 155.73,40.32 155.73,24.13 156.53,23.34 SLOT4.B14 | v16.03,47.15 16.03,49.85 13.81,49.85 ZTURN.CN1_38 | v88.9,22.86 v88.9,41.75 | v95.73,22.86 95.73,22.38 97.16,22.38 97.63,22.86 97.63,23.18 103.19,23.18 SLOT1.B14
  Route2 0.102: SLOT1.B14 103.35,23.18 103.98,22.54 114.94,22.54 115.57,23.18 120.97,23.18 SLOT2.B14 121.13,23.34 121.76,23.97 132.72,23.97 133.51,23.18 138.75,23.18 SLOT3.B14
  Bottom 0.102: v135.25,97.63 135.41,97.79 v157.96,97.79 | SLOT3.B14 138.91,23.18 139.7,22.38 151.13,22.38 151.92,23.18 156.53,23.18 SLOT4.B14 | v16.03,47.15 16.19,46.99 64.61,46.99 66.99,44.61 86.04,44.61 v88.9,41.75 | SLOT0.B14 85.57,23.18 85.72,23.02 88.74,23.02 v88.9,22.86 v95.73,22.86
!LO_MPD!  (via drill 0.3)
  Top 0.102: v141.45,81.6 141.45,83.03 U$4.3 | v15.56,47.78 15.56,48.58 13.81,48.58 ZTURN.CN1_40 | v78.42,47.62 78.26,47.47 78.26,41.59 78.11,41.43 78.11,40.16 78.9,39.37 SLOT0.A30
  Route2 0.102: v141.45,81.6 141.45,47.94 150.02,39.37 SLOT4.A30
  Bottom 0.102: SLOT4.A30 150.02,39.21 140.02,39.21 139.22,38.42 138.59,38.42 137.95,39.05 132.56,39.05 132.4,39.21 SLOT3.A30 132.24,39.21 122.24,39.21 121.44,38.42 120.81,38.42 120.17,39.05 114.78,39.05 114.62,39.21 SLOT2.A30 114.46,39.21 104.46,39.21 103.66,38.42 102.39,38.42 101.76,39.05 97,39.05 96.84,39.21 SLOT1.A30 96.68,39.21 86.68,39.21 85.88,38.42 84.61,38.42 83.82,39.21 79.06,39.21 SLOT0.A30 | v15.56,47.78 15.72,47.62 v78.42,47.62
!LO_RST!  (via drill 0.3)
  Top 0.102: U$17.3 141.45,76.68 143.35,74.77 143.35,52.23 150.97,44.61 150.97,37.47 152.08,36.35 SLOT4.A27 | v69.53,38.26 68.9,38.89 68.9,58.74 66.83,58.74 ZTURN.CN2_24
  Route15 0.102: SLOT2.A27 116.68,36.35 117.32,36.99 119.38,36.99 120.02,36.35 134.3,36.35 SLOT3.A27 134.46,36.35 135.1,36.99 137.16,36.99 137.79,36.35 152.08,36.35 SLOT4.A27
  Bottom 0.102: v69.53,38.26 70.96,36.83 78.26,36.83 78.74,36.35 80.96,36.35 SLOT0.A27 81.12,36.2 81.92,35.4 83.82,35.4 84.61,36.2 98.74,36.2 SLOT1.A27 98.9,36.35 99.69,37.15 101.6,37.15 102.39,36.35 103.66,36.35 103.98,36.67 113.98,36.67 114.3,36.35 116.52,36.35 SLOT2.A27
!SRST!  (via drill 0.3)
  Top 0.102: v15.4,65.25 13.81,65.25 ZTURN.CN1_14 | v11.27,69.37 5.71,74.93 5.71,86.68 4.13,88.27 AUX_JTAG.6 4.13,88.42 8.1,92.39 8.1,109.22 10,111.12 J1.B7
  Bottom 0.102: v11.27,69.37 v15.4,65.25
+3V3  (via drill 0.3)
  Top 0.102: v99.22,57.15 99.22,57.94 99.06,58.1 C10.1 | IC2.21 102.55,56.36 102.55,55.72 v102.39,55.56 102.39,53.66 103.19,53.66 103.5,53.98 103.5,56.36 IC2.23 | v89.22,60.17 89.22,61.28 IC1.16 89.06,61.44 85.41,65.09 85.41,112.24 82.39,115.25 AUDIO_CONN.7 | v92.08,59.69 92.39,59.37 92.39,56.67 | 92.39,56.67 92.39,55.56 IC1.6 92.55,55.4 92.55,53.34 C7.1 92.39,53.34 92.39,16.67 v94.14,14.92 | 92.39,56.67 v92.71,56.67 | 70.64,60.17 70.64,70.01 72.07,71.44 72.55,71.44 ZTURN.CN2_3 | 70.64,60.17 70.64,41.12 72.55,41.12 ZTURN.CN2_51 | 70.64,60.17 v70.8,60.17 | U$4.1 140.34,83.03 139.86,82.55 139.86,81.92 C5.1 139.86,81.76 v139.86,81.12 | U$15.1 133.99,79.22 133.51,78.74 v133.51,78.58 133.51,78.11 C14.1 | 133.83,72.71 133.51,72.39 133.51,71.75 C60.1 | 133.83,72.71 133.99,72.87 U$8.1 | U$17.1 140.34,76.68 139.86,76.2 139.86,75.56 C63.1 139.7,75.41 139.7,74.77 v138.43,74.77 | v133.51,73.03 133.83,72.71 | U$16.1 140.34,95.73 139.86,95.25 139.86,94.61 C4.1 139.7,94.46 v139.7,93.66 | U$14.1 140.34,89.38 139.86,88.9 v139.86,88.74 139.86,88.27 C65.1 | U$6.1 133.99,98.27 133.51,97.79 133.51,97.16 C6.1 133.35,97 133.35,94.93 133.03,94.61 133.03,90.33 | 133.83,85.41 133.51,85.09 133.51,84.45 C1.1 | 133.83,85.41 133.99,85.57 U$5.1 | U$9.1 133.99,91.92 133.51,91.44 133.51,90.81 C57.1 133.35,90.65 133.03,90.33 | 133.83,85.41 133.03,86.2 133.03,88.74 | 133.03,90.33 133.03,88.74 | 133.03,88.74 v134.14,88.74 | 133.51,129.06 133.51,128.27 LVL_D.1 | 133.51,129.06 133.51,129.54 C13.1 | LVL_ALO.1 133.51,114.3 133.51,115.57 C3.1 133.67,115.73 v133.67,116.36 | 133.51,142.4 133.51,142.24 LVL_AHI.1
  Top 0.102: 133.51,142.4 133.51,143.51 C17.1 | v135.73,117.79 135.57,117.95 135.57,130.02 | 135.57,130.02 135.57,140.34 133.51,142.4 | 133.51,129.06 134.62,129.06 v134.62,130.02 | 135.57,130.02 v135.89,130.02 | 21.43,62.71 21.43,42.39 19.68,42.39 ZTURN.CN1_49 | 21.43,62.71 20.32,63.82 19.68,63.82 ZTURN.CN1_15 | 21.43,71.44 19.68,71.44 ZTURN.CN1_3 | 21.43,62.71 21.43,71.44 | 15.56,149.86 15.56,152.4 R20.2 | 15.56,147.32 15.56,144.78 | 15.56,137.16 15.56,134.62 R14.2 15.4,134.62 15.4,128.43 10.48,123.51 | 15.56,142.24 15.56,139.7 | 15.56,139.7 15.56,137.16 | 15.56,137.16 R12.2 | 15.56,139.7 R11.2 | 15.56,142.24 15.56,144.78 | 15.56,144.78 R8.2 | 15.56,142.24 R9.2 | 15.56,147.32 15.56,149.86 | 15.56,149.86 R18.2 | 15.56,147.32 R7.2 | AUX_JTAG.1 4.13,101.12 7.14,104.14 7.14,121.13 9.05,123.03 10,123.03 J1.B1 | 10.48,123.51 10.16,123.19 J1.B1 | 21.43,71.44 21.43,112.55 10.48,123.51 | 10.48,123.51 J1.B1
  Route2 0.102: v94.14,14.92 98.74,10.32 SLOT1.A3 | v133.51,73.03 v133.51,78.58
  Route15 0.102: v139.86,88.74 v139.86,81.12 | v139.7,93.66 139.7,110.33 v133.67,116.36
  Bottom 0.102: SLOT1.A3 98.9,10.16 99.69,9.37 101.44,9.37 102.39,8.41 113.67,8.41 114.46,9.21 SLOT2.A2 114.62,9.21 114.78,9.05 120.17,9.05 120.81,8.41 131.44,8.41 132.24,9.21 SLOT3.A2 | SLOT3.A2 132.4,9.37 133.19,10.16 134.3,10.16 SLOT3.A3 | SLOT4.A1 152.08,8.41 137.95,8.41 137.16,9.21 132.4,9.21 SLOT3.A2 | v102.39,55.56 100.81,55.56 v99.22,57.15 98.74,56.67 v92.71,56.67 | v92.08,59.69 89.69,59.69 v89.22,60.17 v70.8,60.17 | v133.51,73.03 133.51,74.77 v138.43,74.77 | v139.86,81.12 137.79,79.06 133.99,79.06 v133.51,78.58 | v134.14,88.74 134.94,88.74 | 134.94,88.74 v139.86,88.74 | v139.7,93.66 139.7,91.76 135.25,91.76 134.94,91.44 134.94,88.74 | v135.73,117.79 135.1,117.79 v133.67,116.36 108.9,116.36 108.11,117.16 84.14,117.16 AUDIO_CONN.7 82.39,115.25 83.5,114.14 83.5,112.24 79.53,112.24 76.83,109.54 38.58,109.54 37.15,108.11 INTERNAL_EXP.8 36.99,108.11 35.08,108.11 INTERNAL_EXP.6 34.92,107.95 33.81,106.84 9.84,106.84 4.13,101.12 AUX_JTAG.1 | v135.89,130.02 v134.62,130.02
+5V  (via drill 0.3)
  Top 0.305: U$9.6 133.99,92.71 133.51,93.19 133.51,93.82 C71.1 133.51,93.98 v133.51,94.46 | 133.91,99.14 133.51,99.54 133.51,100.17 C9.1 | 133.91,99.14 133.99,99.06 U$6.6 | v133.51,98.58 133.83,98.9 133.83,99.06 133.91,99.14 | U$8.6 133.99,73.66 133.51,74.14 133.51,74.77 C67.1 133.35,74.93 133.35,75.72 132.87,76.2 132.87,78.74 133.99,79.85 U$15.6 133.99,80.01 133.99,80.64 C2.1 133.83,80.64 133.51,80.64 v133.51,83.5 | C11.1 139.86,97.63 139.86,97 140.34,96.52 U$16.6 140.34,96.36 139.06,95.09 v139.06,93.19 139.06,92.08 139.7,91.44 C12.1 139.86,91.28 139.86,90.65 140.34,90.17 U$14.6 140.34,90.01 139.22,88.9 139.22,86.36 v139.06,86.36 139.7,85.72 139.7,85.09 C8.1 139.86,84.93 139.86,84.3 140.34,83.82 U$4.6 140.34,83.66 139.22,82.55 139.22,79.22 139.7,78.74 C68.1 139.86,78.58 139.86,77.95 140.34,77.47 U$17.6 | 133.59,86.76 133.51,86.84 133.51,87.47 C72.1 | 133.59,86.76 133.99,86.36 U$5.6 | v133.51,86.52 133.51,86.68 133.59,86.76 | LVL_D.23 139.38,127.64 139.38,128.11 LVL_D.24 139.22,128.27 139.22,129.06 C18.1 139.38,129.06 v139.86,129.06 | LVL_AHI.23 139.38,141.6 139.38,142.08 LVL_AHI.24 139.22,142.24 139.22,143.51 C16.1 139.06,143.67 139.06,144.15 138.43,144.15 138.35,144.07 | LVL_ALO.23 139.38,113.67 139.38,114.14 LVL_ALO.24 139.22,114.3 v138.75,114.78 | 137.32,128.91 137.32,143.03 138.35,144.07 | 137.32,128.91 137.32,115.73 C15.1 137.48,115.57 v137.48,114.94 137.48,102.39 v135.89,100.81 | 137.32,128.91 v138.11,128.91 | C53.1 88.42,9.05 85.57,9.05 85.57,9.21 SLOT0.B2 | C54.1 106.2,9.05 103.35,9.05 103.35,9.21 SLOT1.B2 | C55.1 123.98,9.05 121.13,9.05 121.13,9.21 SLOT2.B2
  Top 0.305: C56.1 141.76,9.05 138.91,9.05 138.91,9.21 SLOT3.B2 | C81.1 159.54,9.05 159.23,8.73 159.23,6.83 159.86,6.19 160.34,6.19 160.34,4.92 160.18,4.76 154.78,4.76 154.78,8.26 SLOT4.B1 | v17.3,61.44 17.14,61.59 17.14,72.71 19.53,72.71 ZTURN.CN1_1 | v72.71,110.97 72.71,72.87 ZTURN.CN2_1 | 138.35,144.07 137.32,145.1 v137.32,152.56
  Route2 0.305: v133.51,86.52 v133.51,83.5
  Bottom 0.305: v133.51,86.52 133.67,86.36 v139.06,86.36 | v139.06,93.19 138.27,93.98 133.99,93.98 v133.51,94.46 v133.51,98.58 135.73,100.81 v135.89,100.81 | v138.75,114.78 138.59,114.94 v137.48,114.94 | v139.86,129.06 139.7,128.91 v138.11,128.91 | v17.3,61.44 16.99,61.12 5.08,61.12 BOARD_POWER.2 | v72.71,110.97 76.04,114.3 81.28,114.3 AUDIO_CONN.5 | v137.32,152.56 137.32,157.48 U$1.41
  pour Route15: -2.54,172.72 172.72,172.72 172.72,-2.54 -2.54,-2.54
CFG0  (via drill 0.3)
  Top 0.102: SW_CONFIG.1 R14.1 | v104.46,55.56 104.46,56.83 104.78,57.15 IC2.1 | v87.95,54.61 85.09,57.47 85.09,103.19 73.98,114.3 v73.98,117
  Bottom 0.102: v104.46,55.56 103.5,54.61 v87.95,54.61 | v73.98,117 66.04,124.94 21.11,124.94 SW_CONFIG.1
CFG1  (via drill 0.3)
  Top 0.102: SW_CONFIG.2 R12.1 | v105.09,56.52 105.41,56.83 105.41,57.63 104.93,57.63 IC2.2
  Route15 0.102: v105.09,56.52 103.19,56.52 53.98,105.73 53.98,108.27 25.08,137.16 SW_CONFIG.2
CFG2  (via drill 0.3)
  Top 0.102: SW_CONFIG.3 R11.1 | v96.04,117.63 95.89,117.47 95.89,65.88 96.2,65.56 96.2,51.59 102.87,51.59 105.73,54.45 105.73,58.1 104.93,58.1 IC2.3
  Bottom 0.102: v96.04,117.63 88.42,125.25 25.88,125.25 SW_CONFIG.3
CFG3  (via drill 0.3)
  Top 0.102: SW_CONFIG.4 R9.1 | v97.31,127.79 97.31,120.81 105.73,112.39 105.73,58.74 104.93,58.74 IC2.4
  Bottom 0.102: v97.31,127.79 26.99,127.79 12.54,142.24 SW_CONFIG.4
CFG4  (via drill 0.3)
  Top 0.102: SW_CONFIG.5 R8.1 | v97.31,117.63 105.41,109.54 105.41,59.21 104.93,59.21 IC2.5
  Bottom 0.102: v97.31,117.63 89.38,125.57 27.15,125.57 13.18,139.54 13.18,141.29 10.32,141.29 9.68,141.92 9.68,144.78 SW_CONFIG.5
CFG5  (via drill 0.3)
  Top 0.102: SW_CONFIG.6 R7.1 | v97,129.06 96.84,128.91 96.84,117.47 104.46,109.86 104.46,60.01 104.78,59.69 IC2.6
  Bottom 0.102: v97,129.06 94.77,131.29 27.46,131.29 SW_CONFIG.6
CFG6  (via drill 0.3)
  Top 0.102: SW_CONFIG.7 R18.1 | v96.52,139.54 96.52,116.68 96.84,116.36 96.84,66.04 100.17,66.04 103.98,62.23 103.98,60.48 IC2.7
  Bottom 0.102: v96.52,139.54 91.44,144.62 16.67,144.62 SW_CONFIG.7
CFG7  (via drill 0.3)
  Top 0.102: SW_CONFIG.8 R20.1 15.08,152.4 15.08,152.88 17.46,152.88 v69.85,100.49 | v96.36,87.79 96.36,65.72 100.17,65.72 103.5,62.39 103.5,60.48 IC2.8
  Bottom 0.102: v96.36,87.79 83.66,100.49 v69.85,100.49
DIR_A  (via drill 0.3)
  Top 0.102: R26.1 132.72,143.35 132.72,141.92 133.03,141.6 133.35,141.6 LVL_AHI.2 133.51,141.45 134.14,141.45 135.25,140.34 135.25,113.67 134.94,113.67 | 134.94,113.67 133.51,113.67 LVL_ALO.2 | v21.91,87.47 21.91,41.75 18.41,41.75 18.26,41.91 18.26,44.77 19.53,44.77 ZTURN.CN1_45 | v134.3,102.23 134.94,102.87 134.94,113.67
  Bottom 0.102: v21.91,87.47 26.99,92.55 61.28,92.55 70.96,102.23 v134.3,102.23
DIR_D  (via drill 0.3)
  Top 0.102: 132.87,127.79 133.03,127.64 133.35,127.64 LVL_D.2 | 132.87,127.79 132.72,127.95 132.72,129.38 R25.1 | v132.4,127.32 132.87,127.79 | v42.39,127.32 25.24,110.17 v25.24,60.17 | v18.1,58.1 21.11,58.1 21.11,44.45 20.32,43.66 19.68,43.66 ZTURN.CN1_47
  Bottom 0.102: v42.39,127.32 v132.4,127.32 | v25.24,60.17 23.18,58.1 v18.1,58.1
DIR_EXTSEL  (via drill 0.3)
  Top 0.102: 134.94,87 134.94,87.47 R3.1 | 134.94,87 134.94,86.68 134.62,86.36 U$5.5 | v134.46,87 134.94,87 | v16.99,81.12 16.19,80.33 16.19,65.41 14.76,63.98 13.81,63.98 ZTURN.CN1_16
  Bottom 0.102: v134.46,87 22.86,87 v16.99,81.12
DIR_HALT  (via drill 0.3)
  Top 0.102: U$8.5 134.62,73.66 134.94,73.98 134.94,74.77 R19.1 134.94,74.93 v134.46,75.41 | v15.4,63.66 14.45,62.71 13.81,62.71 ZTURN.CN1_18
  Route2 0.102: v23.34,69.22 17.78,63.66 v15.4,63.66
  Bottom 0.102: v134.46,75.41 134.14,75.09 29.21,75.09 v23.34,69.22
DIR_IRQ  (via drill 0.3)
  Top 0.102: U$6.5 134.62,99.06 134.94,99.38 134.94,100.17 R4.1 134.94,100.33 v134.94,101.28 | v20.64,92.55 17.46,89.38 17.46,73.5 16.83,72.87 16.83,59.05 15.24,57.47 15.24,57.15 15.08,56.99 12.38,56.99 12.38,57.94 12.7,58.26 15.24,58.26 15.24,60.48 14.45,61.28 13.81,61.28 ZTURN.CN1_20
  Bottom 0.102: v134.94,101.28 134.94,102.71 30.8,102.71 v20.64,92.55
DIR_MPD  (via drill 0.3)
  Top 0.102: U$4.5 140.97,83.82 141.29,84.14 141.29,84.93 R5.1 141.29,85.09 v140.81,85.57 | v16.99,73.66 16.51,73.18 16.51,65.09 15.88,64.45 15.88,62.87 14.92,61.91 12.38,61.91 12.38,60.8 13.02,60.17 13.65,60.17 ZTURN.CN1_22
  Bottom 0.102: v140.81,85.57 140.49,85.88 29.21,85.88 v16.99,73.66
DIR_RST  (via drill 0.3)
  Top 0.102: 141.29,78.11 141.29,78.58 R21.1 | 141.29,78.11 141.29,77.79 140.97,77.47 U$17.5 | v140.81,78.11 141.29,78.11 | v16.35,64.29 16.19,64.14 16.19,58.9 14.92,57.63 13.81,57.63 ZTURN.CN1_26
  Bottom 0.102: v140.81,78.11 139.22,76.52 37.78,76.52 31.59,82.71 31.27,82.71 16.35,67.79 v16.35,64.29
DIR_RW  (via drill 0.3)
  Top 0.102: 134.94,93.34 134.94,93.82 R22.1 | 134.94,93.34 134.94,93.03 134.62,92.71 U$9.5 | v134.46,93.34 134.94,93.34 | v17.3,59.21 15.56,57.47 15.56,57.15 14.76,56.36 13.81,56.36 ZTURN.CN1_28
  Route2 0.102: v17.3,59.21 v45.56,87.47
  Bottom 0.102: v134.46,93.34 134.3,93.19 102.39,93.19 96.52,87.31 45.72,87.31 v45.56,87.47
GND  (via drill 0.3)
  Top 0.102: 134.14,116.68 134.14,120.33 133.51,120.97 LVL_D.12 133.51,121.13 133.51,121.6 LVL_D.11 | 134.14,116.68 134.14,115.73 C3.2 | 137.95,107.16 139.22,107.16 LVL_ALO.13 | 137.95,112.87 137.95,115.57 C15.2 137.95,115.73 v138.91,116.68 139.22,117 139.22,120.97 LVL_D.13 139.22,121.13 138.27,121.13 138.27,126.52 138.59,126.84 | 137.95,112.87 137.95,107.16 | 137.95,112.87 139.22,112.87 LVL_ALO.22 | v134.62,116.68 134.14,116.68 | 133.35,130.02 132.72,130.02 R25.2 | 133.35,130.02 133.83,130.02 133.99,129.86 133.99,129.7 C13.2 | 133.35,130.02 133.35,134.94 LVL_AHI.12 133.51,135.1 133.51,135.57 LVL_AHI.11 133.51,135.73 v134.46,135.73 | 138.59,141.29 138.59,143.51 C16.2 | 138.59,141.29 139.06,140.81 139.22,140.81 LVL_AHI.22 | 139.22,134.78 139.22,134.94 LVL_AHI.13 | 139.22,134.78 139.22,129.7 | 139.22,129.7 139.22,129.54 C18.2 | 138.59,126.84 139.22,126.84 LVL_D.22 | 138.59,126.84 138.59,129.06 139.22,129.7 | 138.59,141.29 137.79,141.29 137.79,136.21 137.95,136.05 | 139.22,134.78 137.95,136.05 | 137.95,136.05 v137.95,135.89 | U$4.2 140.97,83.03 140.34,82.39 140.34,81.92 C5.2 140.34,81.76 140.34,81.12 | 140.34,81.12 140.34,80.33 | 140.34,80.33 140.34,78.74 C68.2 | 140.34,80.33 141.76,78.9 141.76,78.74 R21.2 141.92,78.58 142.56,77.95 v142.56,76.83 | C11.2 140.34,97.63 140.97,97 140.97,96.52 U$16.5 140.97,96.36 140.97,95.89 U$16.2 140.97,95.73 140.97,95.25 140.34,94.61 C4.2 140.34,94.46 140.34,91.44 C12.2 140.34,91.28 140.97,90.65 140.97,90.17 U$14.5 140.97,90.01 140.97,89.53 U$14.2 140.97,89.38 140.34,88.74 140.34,88.27 C65.2 140.34,88.11 140.34,86.68 | 140.34,86.68 140.34,85.09 C8.2
  Top 0.102: 140.34,86.68 141.76,85.25 141.76,85.09 R5.2 141.92,84.93 141.92,84.61 142.56,83.98 142.56,81.12 140.34,81.12 | U$5.2 134.62,85.57 133.99,84.93 133.99,84.45 C1.2 133.99,84.3 133.99,83.98 | 133.99,81.12 134.62,80.49 134.62,80.01 U$15.5 134.62,79.85 134.62,79.38 U$15.2 134.62,79.22 133.99,78.58 133.99,78.11 C14.2 133.99,77.95 133.99,76.52 | 133.99,81.12 133.99,83.98 | 133.99,81.12 C2.2 | U$17.2 140.97,76.68 140.34,76.04 140.34,75.56 C63.2 140.18,75.41 v140.18,74.77 | U$8.2 134.62,72.87 v133.99,72.23 133.99,71.75 C60.2 | 133.99,76.52 133.99,74.93 C67.2 133.99,74.77 133.99,74.61 v134.3,74.3 | 133.99,76.52 135.41,75.09 135.41,74.93 R19.2 | 133.51,101.76 133.51,107 LVL_ALO.12 133.51,107.16 133.51,107.63 LVL_ALO.11 | 133.51,101.76 133.51,100.97 | 133.51,100.97 133.51,100.65 133.83,100.33 C9.2 | 133.51,101.76 135.1,101.76 135.41,101.44 135.41,100.33 R4.2 135.57,100.17 135.73,100.01 | U$9.2 134.62,91.92 133.99,91.28 133.99,90.81 C57.2 133.99,90.65 134.62,90.01 | 134.62,88.27 133.99,87.63 C72.2 | 134.62,88.27 135.41,88.27 135.41,87.63 R3.2 | 134.62,88.27 134.62,90.01 | U$6.2 134.62,98.27 133.99,97.63 133.99,97.16 C6.2 133.99,97 133.99,95.57 | 133.99,95.57 133.99,93.98 C71.2 | 133.99,95.57 134.46,95.09 | 134.46,95.09 135.41,94.14 135.41,93.98 R22.2 135.57,93.82 135.89,93.5 135.89,90.01 134.62,90.01 | 135.73,100.01 136.53,99.22 136.53,97.16 134.46,95.09 | 133.99,83.98 132.72,83.98 132.72,95.09 133.03,95.41 133.03,100.49 133.51,100.97 | 137.95,107.16 137.79,107 137.79,102.08 135.73,100.01 | ZTURN.CN2_2 66.83,72.71 66.83,71.6 ZTURN.CN2_4 66.67,71.44 65.41,71.44 65.41,60.64
  Top 0.102: 65.41,55.09 66.67,55.09 ZTURN.CN2_30 | 65.41,60.64 65.41,55.09 | 65.41,60.64 66.04,61.28 66.67,61.28 ZTURN.CN2_20 | ZTURN.CN2_80 66.83,23.34 68.9,23.34 68.9,28.57 67.94,29.53 66.83,29.53 ZTURN.CN2_70 66.67,29.69 65.41,29.69 65.41,32.7 65.56,32.86 69.53,32.86 69.53,33.5 | 70.96,32.07 70.96,33.5 72.07,34.61 72.55,34.61 ZTURN.CN2_61 | 70.96,32.07 70.96,28.42 72.55,28.42 ZTURN.CN2_71 | 68.26,35.88 69.53,35.88 69.53,33.5 | 68.26,35.88 66.83,35.88 ZTURN.CN2_60 | 70.96,32.07 69.53,33.5 | 68.26,35.88 68.26,42.23 66.83,42.23 ZTURN.CN2_50 66.67,42.39 66.04,42.39 65.41,43.02 65.41,46.67 67.94,46.67 68.26,46.99 68.26,48.58 66.83,48.58 ZTURN.CN2_40 66.67,48.74 66.04,48.74 65.41,49.37 65.41,50.48 67.94,50.48 68.26,50.8 68.26,53.02 | 65.41,55.09 65.41,53.18 65.56,53.02 68.26,53.02 | 17.46,55.56 17.46,56.36 18.57,57.47 19.53,57.47 ZTURN.CN1_25 | 17.46,55.56 17.46,51.28 19.53,51.28 ZTURN.CN1_35 | ZTURN.CN1_2 13.81,72.71 13.81,71.6 ZTURN.CN1_4 13.65,71.44 12.06,71.44 12.06,68.9 | 12.38,38.89 12.38,30.96 13.65,30.96 ZTURN.CN1_68 13.81,30.96 13.81,31.11 v15.56,31.11 | 12.38,38.89 13.18,39.69 13.65,39.69 ZTURN.CN1_54 | v17.94,30.96 19.53,30.96 ZTURN.CN1_67 | 12.38,46.04 13.65,46.04 ZTURN.CN1_44 | 12.38,38.89 12.38,46.04 | 12.38,52.39 13.65,52.39 ZTURN.CN1_34 | 12.38,46.04 12.38,52.39 | 12.06,58.74 13.65,58.74 ZTURN.CN1_24 | 12.06,55.56 12.06,52.7 12.38,52.39 | 12.06,55.56 12.06,58.74 | 12.06,58.74 12.06,68.9 | 12.06,55.56 17.46,55.56 | J1.A7 4.6,111.28 4.6,113.03 J1.A6 4.6,113.19 4.6,115.09 J1.A5 4.6,115.25 4.6,117 J1.A4 4.6,117.16 4.6,119.06 J1.A3 4.6,119.22 4.6,121.13 J1.A2 4.6,121.28 4.6,123.03 J1.A1 4.45,123.19 3.81,123.83 SW_CONFIG.16
  Top 0.102: 71.28,52.86 71.28,47.47 72.55,47.47 ZTURN.CN2_41 | 71.28,52.86 72.07,53.66 72.55,53.66 ZTURN.CN2_31 72.71,53.82 v74.61,53.82 | 71.28,52.86 71.28,60.01 72.55,60.01 ZTURN.CN2_21 | IC2.25 103.03,58.58 103.03,60.33 IC2.9 103.19,60.48 103.19,62.39 100.81,62.39 99.54,61.12 99.54,59.21 99.06,58.74 C10.2 99.06,58.58 98.58,58.58 v98.58,57.63 | R65.1 160.81,9.53 159.7,9.53 C81.2 159.54,9.53 158.91,8.89 158.91,8.41 | 158.91,8.41 158.91,6.19 159.54,5.56 LD_4P.C | 142.4,9.53 143.03,9.53 R64.1 | 142.4,9.53 141.92,9.53 C56.2 | 141.45,7.46 141.45,7.94 142.4,8.89 142.4,9.53 | 141.45,7.46 141.45,5.87 141.76,5.56 LD_3P.C | 124.62,9.53 125.25,9.53 R63.1 | 124.62,9.53 124.14,9.53 C55.2 | 123.67,7.46 123.67,7.94 124.62,8.89 124.62,9.53 | 123.67,7.46 123.67,5.87 123.98,5.56 LD_2P.C | 106.84,9.53 107.47,9.53 R62.1 | 106.84,9.53 106.36,9.53 C54.2 | 105.89,7.46 105.89,7.94 106.84,8.89 106.84,9.53 | 105.89,7.46 105.89,5.87 106.2,5.56 LD_1P.C | 89.06,9.53 89.69,9.53 R61.1 | 89.06,9.53 88.58,9.53 C53.2 | 89.06,9.53 89.06,7.46 | 89.06,7.46 89.06,5.71 89.22,5.56 LD_0P1.C | 93.03,53.34 93.66,53.98 93.66,55.4 IC1.8 93.82,55.56 v95.41,57.15 | IC1.5 91.76,55.56 91.12,55.56 IC1.4 90.96,55.4 v90.96,40.8 | C17.2 133.99,143.67 133.99,143.83 133.83,143.99 132.72,143.99 R26.2 132.56,143.99 128.27,143.99 U$1.35 | 93.03,53.34 95.57,50.8 95.57,49.69 103.19,42.07 103.19,41.27 SLOT1.B32 | 93.03,53.34 C7.2 | 89.06,7.46 81.12,7.46 81.12,8.26 SLOT0.A1 | 105.89,7.46 98.9,7.46 98.9,8.26 SLOT1.A1 | 123.67,7.46 116.68,7.46 116.68,8.26 SLOT2.A1 | 141.45,7.46 134.46,7.46 134.46,8.26 SLOT3.A1 | 158.91,8.41 155.57,8.41 155.57,8.57 154.78,9.37 152.24,9.37 152.24,10.16 SLOT4.A3
  Top 0.102: 12.06,68.9 4.13,68.9 4.13,85.72 AUX_JTAG.7 | v68.42,53.18 68.26,53.02
  Bottom 0.102: v138.91,116.68 v134.62,116.68 | v134.46,135.73 134.62,135.89 v137.95,135.89 | v133.99,72.23 133.99,74.3 v134.3,74.3 139.7,74.3 v140.18,74.77 140.49,74.77 141.92,76.2 | 141.92,76.2 v142.56,76.83 | v17.94,30.96 17.78,31.11 v15.56,31.11 | v90.96,40.8 90.81,40.96 85.72,40.96 85.57,41.12 SLOT0.B32 | v98.58,57.63 98.11,57.15 v95.41,57.15 89.85,57.15 87.63,54.93 75.72,54.93 v74.61,53.82 69.06,53.82 v68.42,53.18 | 141.92,76.2 148.27,69.85 159.38,69.85 159.54,70.01 U$3.SHIELD1
  pour Route2: -1.27,171.45 171.45,171.45 171.45,-1.27 -1.27,-1.27
HI_A0  (via drill 0.3)
  Top 0.102: v140.34,113.98 140.34,113.03 139.86,112.55 139.86,112.24 139.38,112.24 LVL_ALO.21 | v150.65,72.39 148.75,72.39 U$3.PA1 | v155.57,77.31 157.16,78.9 157.16,115.89 158.59,117.32 CARTRIDGE.P5 | U$1.16 104.46,158.43 104.46,154.78 115.89,143.35 v115.89,115.89
  Route2 0.102: v155.57,77.31 v150.65,72.39
  Bottom 0.102: 142.24,115.89 142.72,116.36 157.64,116.36 158.59,117.32 CARTRIDGE.P5 | 142.24,115.89 v140.34,113.98 | 142.24,115.89 v115.89,115.89
HI_A1  (via drill 0.3)
  Top 0.102: v140.34,112.08 140.02,111.76 140.02,111.6 139.38,111.6 LVL_ALO.20 | v144.3,73.18 144.3,72.07 146.05,72.07 U$3.PB1 | U$1.14 101.92,158.43 101.92,120.65 v105.89,116.68
  Route2 0.102: v144.3,73.18 144.3,73.98 143.19,75.09 143.19,109.22 v140.34,112.08
  Bottom 0.102: 141.13,112.87 142.08,113.82 157.64,113.82 158.59,114.78 CARTRIDGE.P4 | 141.13,112.87 v140.34,112.08 | v105.89,116.68 109.7,112.87 141.13,112.87
HI_A2  (via drill 0.3)
  Top 0.102: v140.34,111.28 140.34,110.97 139.38,110.97 LVL_ALO.19 | v150.02,73.66 150.02,73.34 148.75,73.34 U$3.PA2 | U$1.12 99.38,158.43 99.38,121.76 v105.25,115.89
  Route2 0.102: v150.02,73.66 150.02,76.68 157.48,84.14 157.48,111.12 158.59,112.24 CARTRIDGE.P3
  Bottom 0.102: CARTRIDGE.P3 158.59,112.24 157.64,111.28 v140.34,111.28 139.06,112.55 108.58,112.55 v105.25,115.89
HI_A3  (via drill 0.3)
  Top 0.102: v140.34,110.49 140.34,110.33 139.38,110.33 LVL_ALO.18 | v153.03,109.22 153.03,107.95 152.72,107.63 152.72,86.52 152.88,86.36 152.88,77.31 152.24,76.68 152.24,72.87 146.21,72.87 U$3.PB2
  Route15 0.102: U$1.10 95.25,158.91 96.36,157.8 96.36,152.4 110.49,138.27 115.89,138.27 139.86,114.3 139.86,110.97 v140.34,110.49
  Bottom 0.102: v140.34,110.49 140.65,110.81 153.03,110.81 | 153.03,110.81 157.64,110.81 158.59,109.86 CARTRIDGE.P2 | 153.03,110.81 v153.03,109.22
HI_A4  (via drill 0.3)
  Top 0.102: v140.34,109.7 139.38,109.7 LVL_ALO.17 | v152.56,112.24 152.56,107.79 152.4,107.63 152.4,86.52 152.56,86.36 152.56,77.31 151.92,76.68 151.92,74.14 148.75,74.14 U$3.PA3 | U$1.8 94.3,158.43 v94.3,116.68
  Route15 0.102: v140.34,109.7 143.51,109.7 146.05,112.24 v152.56,112.24 154.78,112.24 CARTRIDGE.PC
  Bottom 0.102: v94.3,116.68 101.28,109.7 v140.34,109.7
HI_A5  (via drill 0.3)
  Top 0.102: v140.81,113.35 140.81,109.06 139.38,109.06 LVL_ALO.16 | v144.15,74.77 144.15,73.66 146.05,73.66 U$3.PB3 | v152.72,76.36 155.1,78.74 155.1,105.57 153.83,106.84 153.83,107.95 153.99,108.11 153.99,109.22 153.83,109.38 153.83,113.82 154.78,114.78 CARTRIDGE.PD | U$1.6 91.76,161.61 119.06,161.61 v119.06,115.41
  Bottom 0.102: CARTRIDGE.PD 154.78,114.78 142.24,114.78 v140.81,113.35 121.13,113.35 v119.06,115.41 | v144.15,74.77 151.13,74.77 v152.72,76.36
HI_A6  (via drill 0.3)
  Top 0.102: v140.34,108.43 139.38,108.43 LVL_ALO.15 | v152.08,107.95 152.08,86.52 152.24,86.36 152.24,77.31 151.61,76.68 151.61,74.93 148.75,74.93 U$3.PA4 | U$1.4 89.22,158.43 89.22,120.49 v93.82,115.89
  Bottom 0.102: 152.08,108.74 159.07,108.74 159.7,109.38 159.7,118.43 155.89,118.43 154.94,117.47 CARTRIDGE.PE | 152.08,108.74 140.65,108.74 v140.34,108.43 139.38,109.38 100.33,109.38 v93.82,115.89 | 152.08,108.74 v152.08,107.95
HI_A7  (via drill 0.3)
  Top 0.102: v140.34,107.63 139.38,107.63 LVL_ALO.14 | v153.51,108.27 153.51,118.59 153.83,118.9 | 153.83,118.9 154.78,119.86 CARTRIDGE.PF | v144.78,74.3 146.05,74.3 U$3.PB4 | v149.86,134.78 153.83,130.81 153.83,118.9
  Bottom 0.102: v140.34,107.63 140.49,107.47 152.72,107.47 v153.51,108.27 160.97,108.27 160.97,81.12 151.76,71.91 147.16,71.91 v144.78,74.3 | U$1.2 86.68,158.43 116.05,158.43 117.16,157.32 117.16,147.64 127.16,147.64 140.02,134.78 v149.86,134.78
HI_A8  (via drill 0.3)
  Top 0.102: 141.92,140.18 139.38,140.18 LVL_AHI.21 | 141.92,140.18 141.92,159.86 143.03,160.97 146.05,160.97 U$1.50 | v151.29,122.4 151.13,122.24 151.13,78.42 151.29,78.26 151.29,75.72 148.75,75.72 U$3.PA5 | 141.92,140.18 146.21,135.89 v146.21,123.19
  Bottom 0.102: CARTRIDGE.PH 154.78,122.4 v151.29,122.4 147,122.4 v146.21,123.19
HI_A9  (via drill 0.3)
  Top 0.102: v140.34,139.54 139.38,139.54 LVL_AHI.20 | U$1.48 142.24,158.75 142.24,141.6 v142.4,141.45 146.69,137.16 v146.69,125.57 | v144.78,75.25 146.05,75.25 U$3.PB5
  Route2 0.102: v144.78,75.25 151.61,82.07 151.61,121.76 154.78,124.94 CARTRIDGE.PJ
  Bottom 0.102: v140.34,139.54 142.24,141.45 v142.4,141.45 | v146.69,125.57 147.16,125.09 154.78,125.09 CARTRIDGE.PJ
HI_A10  (via drill 0.3)
  Top 0.102: v140.81,138.75 139.38,138.75 LVL_AHI.19 | v150.34,133.03 150.81,132.56 150.81,78.42 150.97,78.26 150.97,76.52 148.75,76.52 U$3.PA6
  Bottom 0.102: v140.81,138.75 141.92,137.64 154.78,137.64 CARTRIDGE.PP 154.94,137.64 155.89,137.64 155.89,134.78 155.26,134.14 | v150.34,133.03 151.45,134.14 155.26,134.14 | U$1.46 142.24,158.75 146.53,158.75 160.34,144.94 160.34,134.14 155.26,134.14
HI_A11  (via drill 0.3)
  Top 0.102: U$1.44 139.38,159.07 139.38,157.64 140.34,156.69 140.34,140.49 138.75,140.49 138.59,140.34 138.59,138.27 139.22,138.27 LVL_AHI.18 139.38,138.11 v140.34,138.11 | v144.78,76.04 146.05,76.04 U$3.PB6 | v155.73,94.61 155.89,94.77 155.89,134.14 154.94,135.1 CARTRIDGE.PN
  Bottom 0.102: v144.78,76.04 145.57,76.83 156.21,76.83 158.43,79.06 158.43,94.61 v155.73,94.61 | v140.34,138.11 143.19,135.25 154.78,135.25 CARTRIDGE.PN
HI_A12  (via drill 0.3)
  Top 0.102: v144.15,128.11 144.15,137.48 139.38,137.48 LVL_AHI.17 | v150.02,77.31 148.75,77.31 U$3.PA7 | v151.76,77.47 151.61,77.63 151.61,78.26 151.45,78.42 151.45,121.92 151.76,122.24 v151.76,127 151.76,132.24 149.22,134.78 149.22,161.61 137.48,161.61 U$1.42
  Bottom 0.102: v144.15,128.11 144.62,127.64 151.76,127.64 | 151.76,127.64 154.78,127.64 CARTRIDGE.PK | v150.02,77.31 150.18,77.47 v151.76,77.47 | 151.76,127.64 v151.76,127
HI_A13  (via drill 0.3)
  Top 0.102: v138.27,140.65 138.27,137 139.22,137 LVL_AHI.16 | v134.14,144.78 134.3,144.94 134.3,159.07 U$1.40 | v143.67,81.28 144.15,80.8 144.15,76.99 146.05,76.99 U$3.PB7
  Route2 0.102: v143.67,81.28 143.67,121.6 143.35,121.92 143.35,131.13 138.27,136.21 v138.27,140.65
  Bottom 0.102: v134.14,144.78 v138.27,140.65
HI_A14  (via drill 0.3)
  Top 0.102: v140.34,136.53 140.34,136.37 139.38,136.37 LVL_AHI.15 | v130.65,146.21 129.86,147 129.86,159.07 U$1.38 | v150.02,81.12 150.02,80.01 147.64,80.01 147.64,78.11 148.59,78.11 U$3.PA8
  Route2 0.102: v150.02,81.12 150.02,81.44 147.8,83.66 147.8,129.06 v140.34,136.53
  Bottom 0.102: v130.65,146.21 v140.34,136.53
HI_A15  (via drill 0.3)
  Top 0.102: v140.34,135.73 139.38,135.73 LVL_AHI.14 | v144.78,77.47 144.78,77.63 146.05,77.63 U$3.PB8
  Route2 0.102: v144.78,77.47 144.78,78.58 145.26,79.06 145.26,129.54 140.34,134.46 v140.34,135.73
  Bottom 0.102: v140.34,135.73 119.7,156.37 119.7,160.97 127.32,160.97 U$1.36
HI_CLK  (via drill 0.3)
  Top 0.102: v136.21,78.42 136.21,78.74 135.1,79.85 U$15.4 | v150.02,78.58 148.75,78.58 148.75,78.74 U$3.PA9 | v155.57,79.53 156.21,80.17 156.21,141.45 154.94,142.72 CARTRIDGE.PS
  Bottom 0.102: v136.21,78.42 136.37,78.58 v150.02,78.58 150.97,79.53 v155.57,79.53 | U$1.29 132.87,145.26 138.11,145.26 140.49,142.88 154.78,142.88 CARTRIDGE.PS
HI_D0  (via drill 0.3)
  Top 0.102: v140.97,127.79 140.97,126.21 139.38,126.21 LVL_D.21 | U$3.PB9 146.21,78.42 147.32,78.42 147.32,73.34 147.16,73.18 145.1,73.18 145.1,72.55 145.26,72.39 147.64,72.39 147.64,72.07 147.8,71.91 153.03,71.91 153.03,76.04 156.84,79.85 156.84,128.27 158.59,130.02 CARTRIDGE.P10 | U$1.15 104.14,156.21 v104.14,128.11
  Bottom 0.102: CARTRIDGE.P10 158.59,130.02 157.64,129.06 142.24,129.06 v140.97,127.79 104.46,127.79 v104.14,128.11
HI_D1  (via drill 0.3)
  Top 0.102: v140.34,125.57 139.38,125.57 LVL_D.20 | v150.02,79.53 148.75,79.53 U$3.PA10
  Route15 0.102: v150.02,79.53 150.02,80.49 157.48,87.95 157.48,126.36 158.59,127.48 CARTRIDGE.P9 | U$1.13 103.19,154.62 105.25,154.62 132.08,127.79 138.11,127.79 v140.34,125.57
  Bottom 0.102: v140.34,125.57 141.29,126.52 157.64,126.52 158.59,127.48 CARTRIDGE.P9
HI_D2  (via drill 0.3)
  Top 0.102: v140.34,124.78 139.38,124.78 LVL_D.19 | v144.78,79.22 146.05,79.22 U$3.PB10 | v143.67,80.01 143.19,80.49 143.19,97.79 142.56,98.42 v142.56,124.14
  Route2 0.102: U$1.11 98.9,157.48 100.01,156.37 103.35,156.37 131.92,127.79 137.32,127.79 v140.34,124.78
  Bottom 0.102: v140.34,124.78 141.13,123.98 142.56,123.98 | 142.56,123.98 157.64,123.98 158.59,124.94 CARTRIDGE.P8 | v144.78,79.22 143.99,80.01 v143.67,80.01 | 142.56,123.98 v142.56,124.14
HI_D3  (via drill 0.3)
  Top 0.102: v140.34,128.27 140.34,126.52 138.75,126.52 138.59,126.36 138.59,124.3 139.22,124.3 LVL_D.18 | v142.88,129.54 143.03,129.38 143.03,98.27 143.51,97.79 143.51,82.07 144.46,81.12 144.46,80.49 148.59,80.49 U$3.PA11 | U$1.9 98.9,153.83 v98.9,131.13
  Bottom 0.102: 141.6,129.54 v140.34,128.27 | 141.6,129.54 v142.88,129.54 154.31,129.54 154.78,130.02 CARTRIDGE.PL | v98.9,131.13 100.49,129.54 141.6,129.54
HI_D4  (via drill 0.3)
  Top 0.102: v141.13,124.62 141.13,123.67 139.38,123.67 LVL_D.17 | v144.78,80.01 146.05,80.01 U$3.PB11 | v157.64,80.01 157.48,80.17 157.48,104.62 159.7,106.84 159.7,118.9 158.75,119.86 CARTRIDGE.P6 | v144.62,126.05 v144.62,133.03
  Bottom 0.102: v141.13,124.62 142.56,126.05 v144.62,126.05 159.07,126.05 159.7,125.41 159.7,120.02 158.75,120.02 CARTRIDGE.P6 | v157.64,80.01 v144.78,80.01 | U$1.7 102.87,147.32 127.16,147.32 141.45,133.03 v144.62,133.03
HI_D5  (via drill 0.3)
  Top 0.102: v141.13,123.19 141.13,123.03 139.38,123.03 LVL_D.16 | v143.99,121.92 143.99,98.11 144.15,97.95 144.15,82.55 144.94,81.76 144.94,81.28 148.59,81.28 U$3.PA12 | U$1.5 93.82,153.83 v93.82,126.84
  Bottom 0.102: 141.6,123.67 v141.13,123.19 | 143.99,123.67 157.48,123.67 158.59,122.56 CARTRIDGE.P7 | 143.99,123.67 141.6,123.67 | 143.99,123.67 v143.99,121.92 | v93.82,126.84 96.68,123.98 134.14,123.98 134.46,123.67 141.6,123.67
HI_D6  (via drill 0.3)